# EAGLE design LinuxBoard_v1.7 (EAGLE 7.2.0)
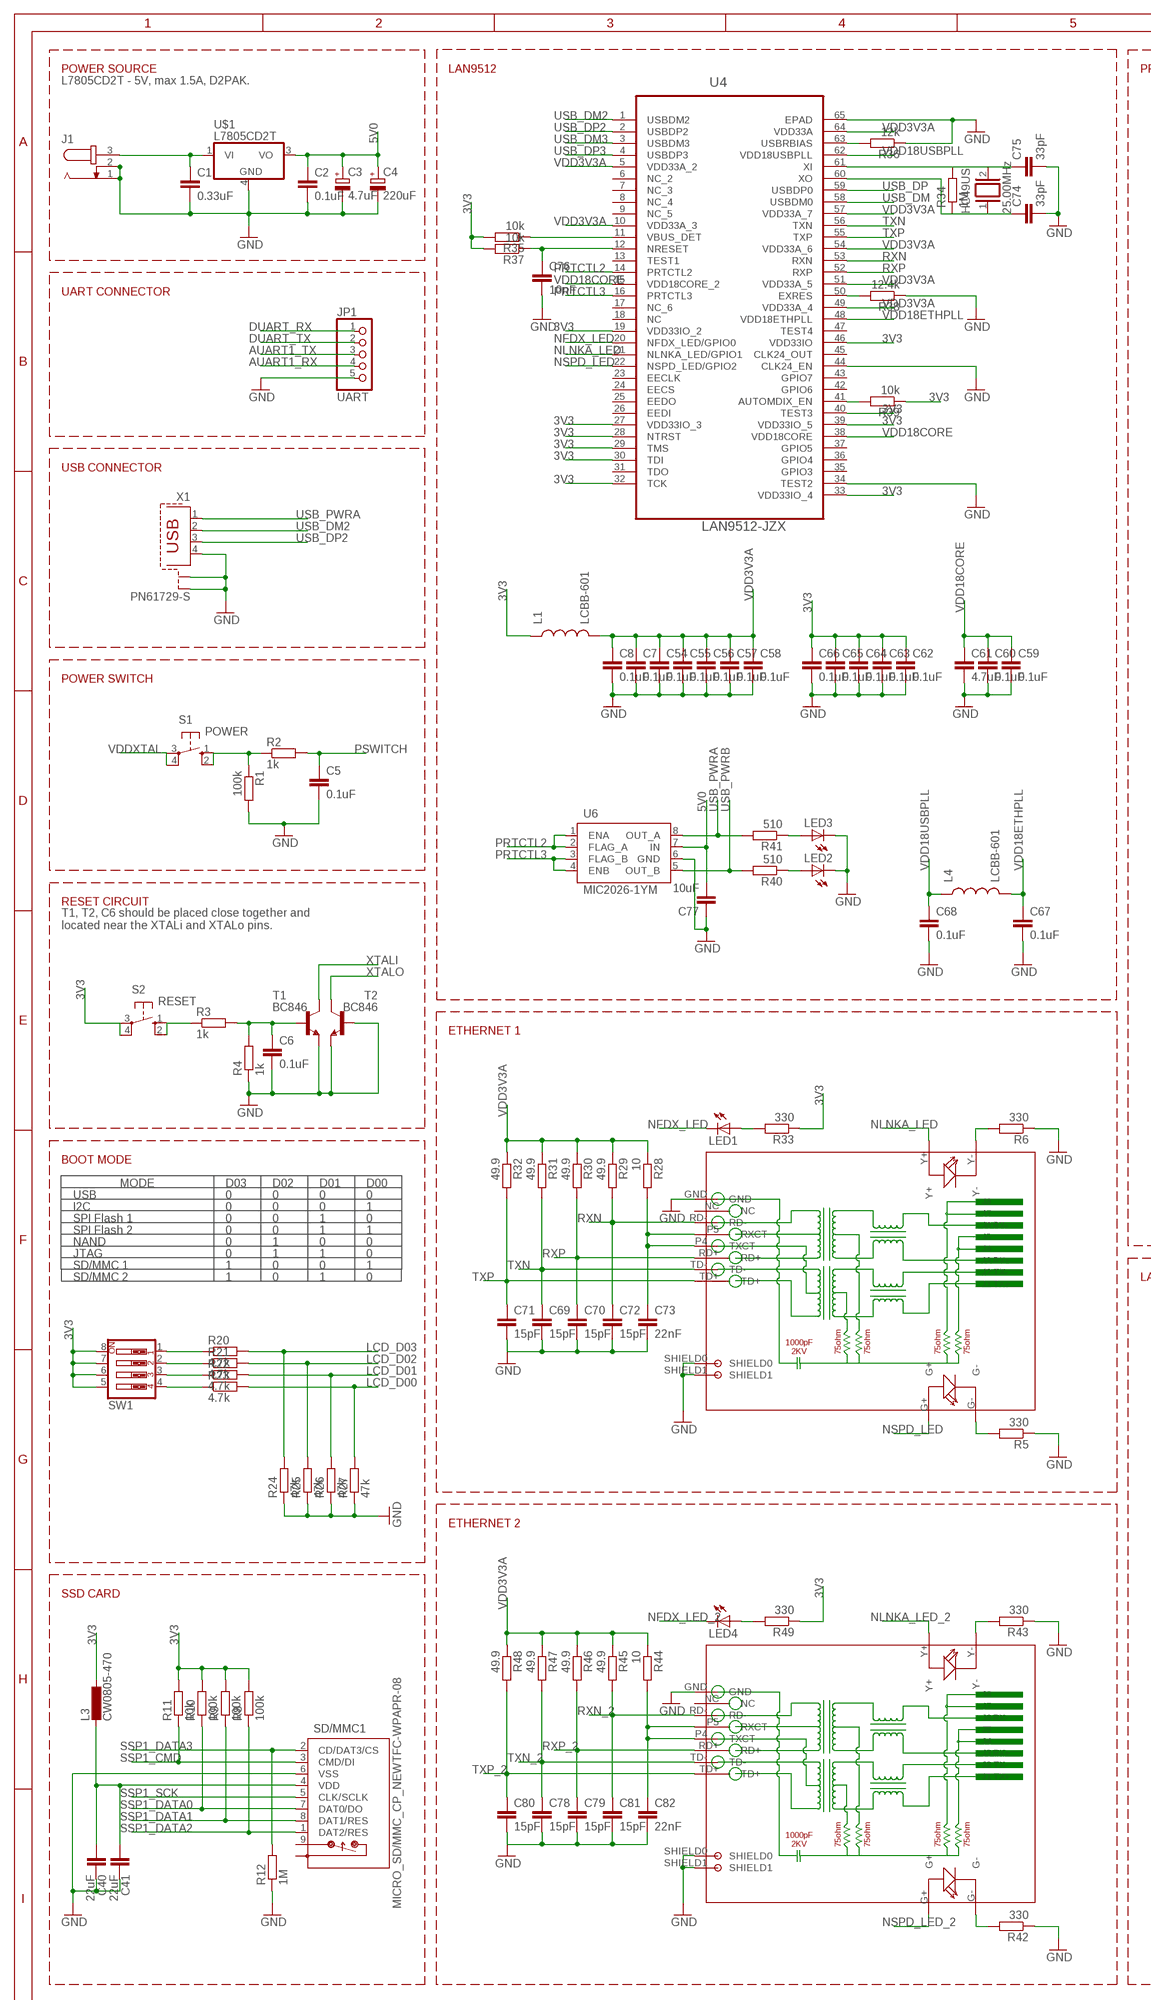
[diagram p0: schematic, sheet 1, part 1 of 2]
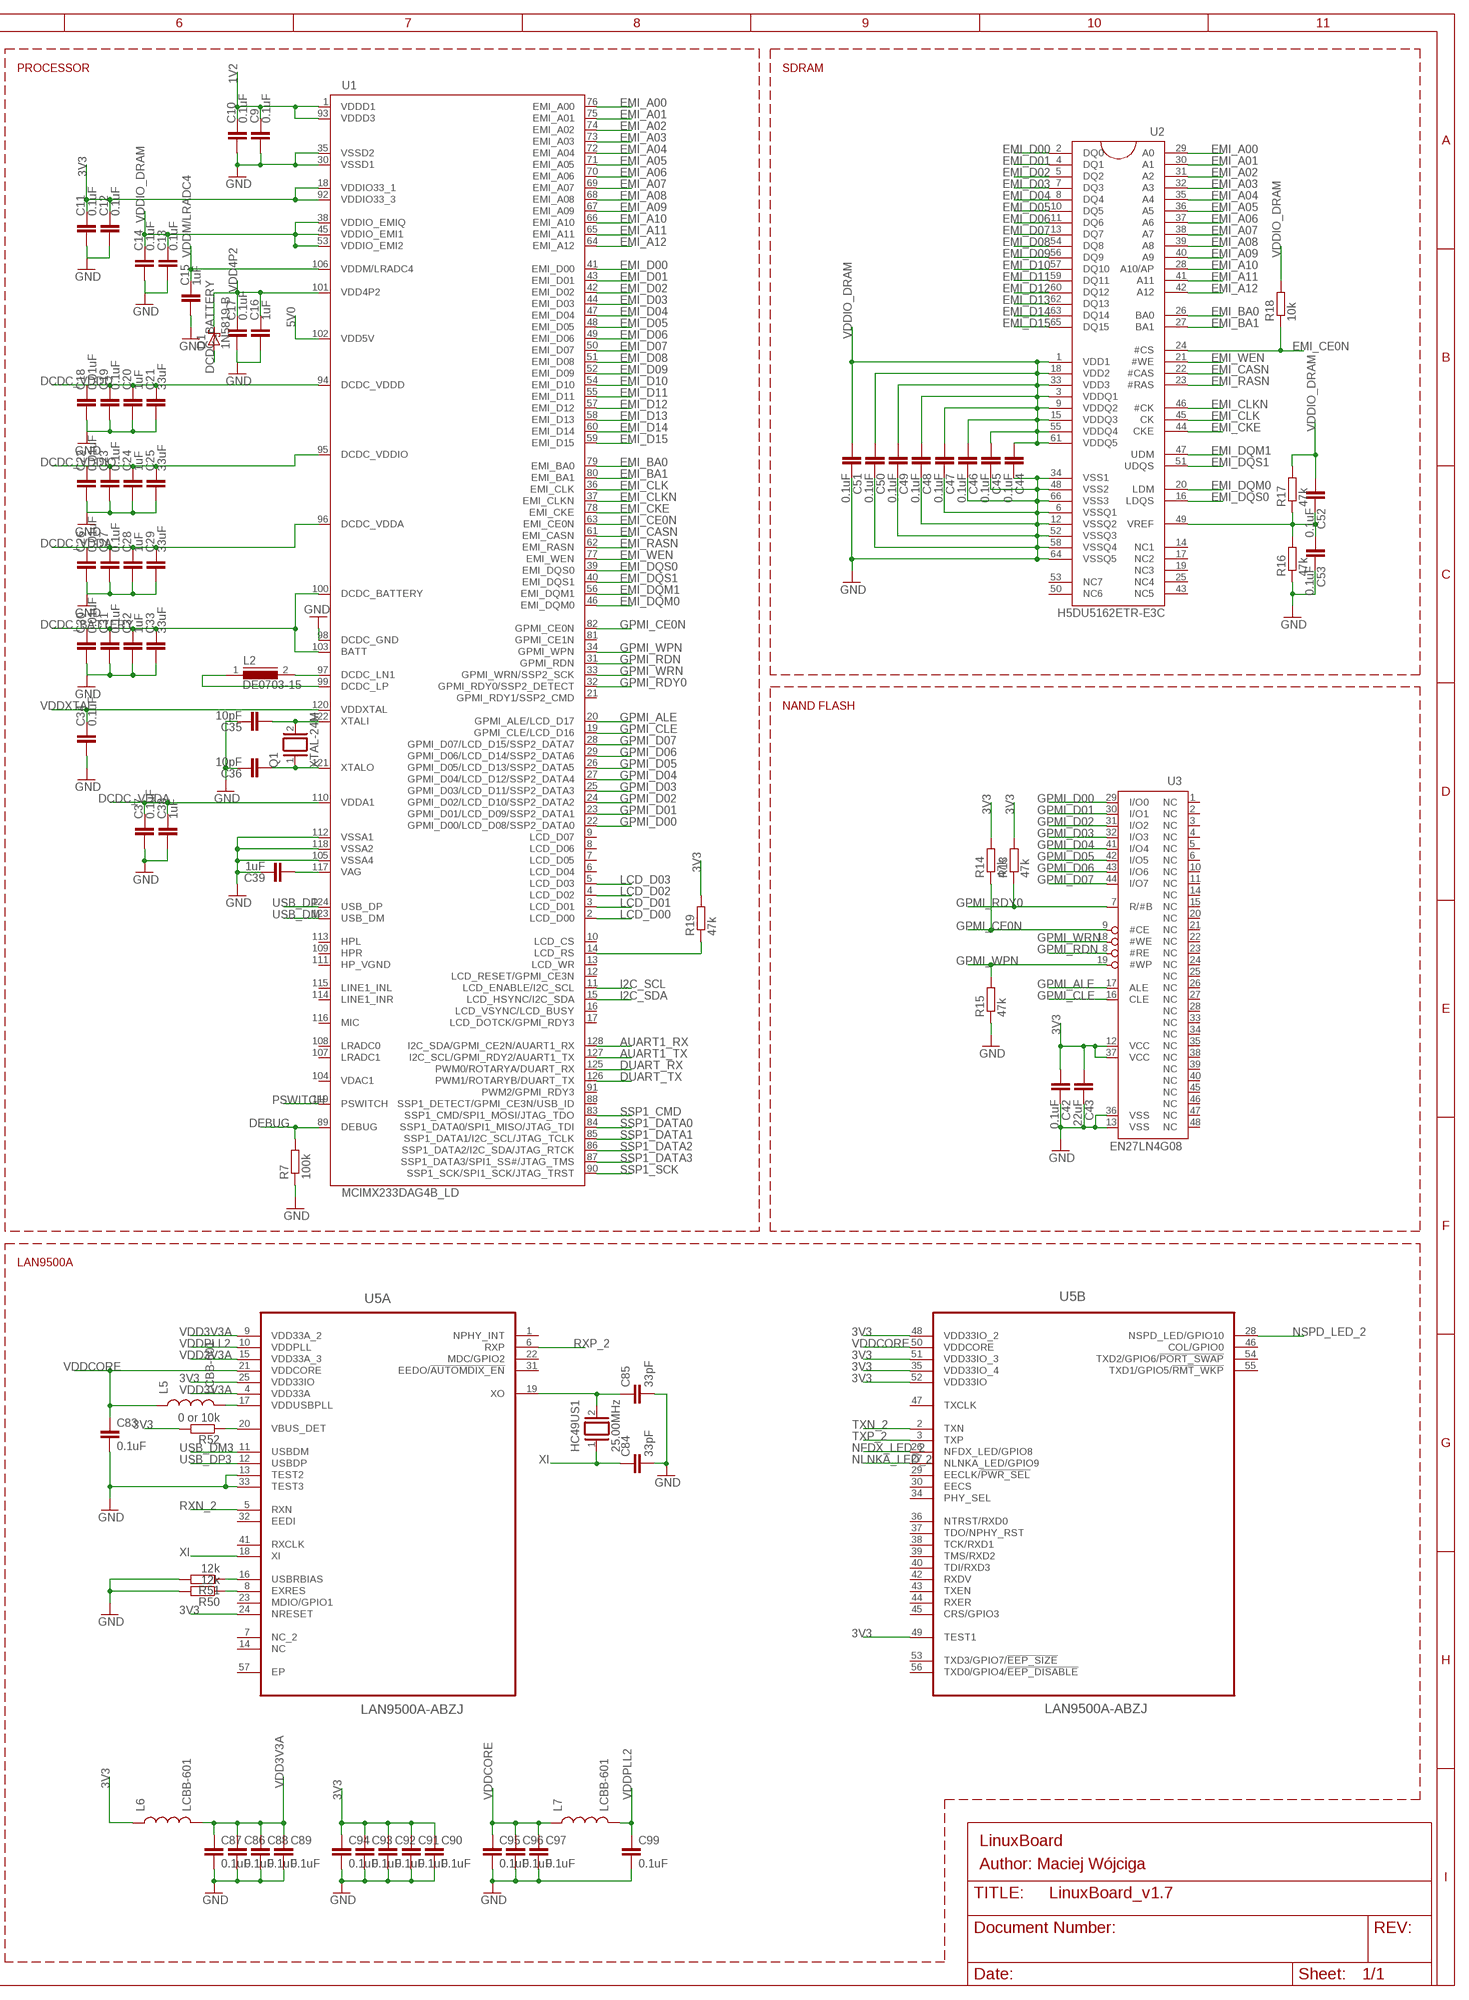
[diagram p1: schematic, sheet 1, part 2 of 2]

## Parts
C1  0.33uF  C-EUC0805  [C0805]
C2  0.1uF  C-EUC0805  [C0805]
C3  4.7uF  CPOL-EUE2-5  [E2-5]
C4  220uF  CPOL-EUE2-5  [E2-5]
C5  0.1uF  C-EUC0805  [C0805]
C6  0.1uF  C-EUC0805  [C0805]
C7  0.1uF  C-EUC0805  [C0805]
C8  0.1uF  C-EUC0805  [C0805]
C9  0.1uF  C-EUC0805  [C0805]
C10  0.1uF  C-EUC0805  [C0805]
C11  0.1uF  C-EUC0805  [C0805]
C12  0.1uF  C-EUC0805  [C0805]
C13  0.1uF  C-EUC0805  [C0805]
C14  0.1uF  C-EUC0805  [C0805]
C15  1uF  C-EUC0805  [C0805]
C16  1uF  C-EUC0805  [C0805]
C17  0.1uF  C-EUC0805  [C0805]
C18  0.01uF  C-EUC0805  [C0805]
C19  0.1uF  C-EUC0805  [C0805]
C20  1uF  C-EUC0805  [C0805]
C21  33uF  C-EUC0805  [C0805]
C22  0.01uF  C-EUC0805  [C0805]
C23  0.1uF  C-EUC0805  [C0805]
C24  1uF  C-EUC0805  [C0805]
C25  33uF  C-EUC0805  [C0805]
C26  0.01uF  C-EUC0805  [C0805]
C27  0.1uF  C-EUC0805  [C0805]
C28  1uF  C-EUC0805  [C0805]
C29  33uF  C-EUC0805  [C0805]
C30  0.01uF  C-EUC0805  [C0805]
C31  0.1uF  C-EUC0805  [C0805]
C32  1uF  C-EUC0805  [C0805]
C33  33uF  C-EUC0805  [C0805]
C34  0.1uF  C-EUC0805  [C0805]
C35  10pF  C-EUC0805  [C0805]
C36  10pF  C-EUC0805  [C0805]
C37  0.1uF  C-EUC0805  [C0805]
C38  1uF  C-EUC0805  [C0805]
C39  1uF  C-EUC0805  [C0805]
C40  22uF  C-EUC0805  [C0805]
C41  22uF  C-EUC0805  [C0805]
C42  0.1uF  C-EUC0805  [C0805]
C43  22uF  C-EUC0805  [C0805]
C44  0.1uF  C-EUC0805  [C0805]
C45  0.1uF  C-EUC0805  [C0805]
C46  0.1uF  C-EUC0805  [C0805]
C47  0.1uF  C-EUC0805  [C0805]
C48  0.1uF  C-EUC0805  [C0805]
C49  0.1uF  C-EUC0805  [C0805]
C50  0.1uF  C-EUC0805  [C0805]
C51  0.1uF  C-EUC0805  [C0805]
C52  0.1uF  C-EUC0805  [C0805]
C53  0.1uF  C-EUC0805  [C0805]
C54  0.1uF  C-EUC0805  [C0805]
C55  0.1uF  C-EUC0805  [C0805]
C56  0.1uF  C-EUC0805  [C0805]
C57  0.1uF  C-EUC0805  [C0805]
C58  0.1uF  C-EUC0805  [C0805]
C59  0.1uF  C-EUC0805  [C0805]
C60  0.1uF  C-EUC0805  [C0805]
C61  4.7uF  C-EUC0805  [C0805]
C62  0.1uF  C-EUC0805  [C0805]
C63  0.1uF  C-EUC0805  [C0805]
C64  0.1uF  C-EUC0805  [C0805]
C65  0.1uF  C-EUC0805  [C0805]
C66  0.1uF  C-EUC0805  [C0805]
C67  0.1uF  C-EUC0805  [C0805]
C68  0.1uF  C-EUC0805  [C0805]
C69  15pF  C-EUC0805  [C0805]
C70  15pF  C-EUC0805  [C0805]
C71  15pF  C-EUC0805  [C0805]
C72  15pF  C-EUC0805  [C0805]
C73  22nF  C-EUC0805  [C0805]
C74  33pF  C-EUC0805  [C0805]
C75  33pF  C-EUC0805  [C0805]
C76  10nF  C-EUC0805  [C0805]
C77  10uF  C-EUC0805  [C0805]
C78  15pF  C-EUC0805  [C0805]
C79  15pF  C-EUC0805  [C0805]
C80  15pF  C-EUC0805  [C0805]
C81  15pF  C-EUC0805  [C0805]
C82  22nF  C-EUC0805  [C0805]
C83  0.1uF  C-EUC0805  [C0805]
C84  33pF  C-EUC0805  [C0805]
C85  33pF  C-EUC0805  [C0805]
C86  0.1uF  C-EUC0805  [C0805]
C87  0.1uF  C-EUC0805  [C0805]
C88  0.1uF  C-EUC0805  [C0805]
C89  0.1uF  C-EUC0805  [C0805]
C90  0.1uF  C-EUC0805  [C0805]
C91  0.1uF  C-EUC0805  [C0805]
C92  0.1uF  C-EUC0805  [C0805]
C93  0.1uF  C-EUC0805  [C0805]
C94  0.1uF  C-EUC0805  [C0805]
C95  0.1uF  C-EUC0805  [C0805]
C96  0.1uF  C-EUC0805  [C0805]
C97  0.1uF  C-EUC0805  [C0805]
C99  0.1uF  C-EUC0805  [C0805]
D1  1N5819-B  [DO41-7.6]
HC49US  25.00MHz  XTAL/S  [QS]
HC49US1  25.00MHz  XTAL/S  [QS]
J1  JACK-PLUG0  [SPC4077]
JP1  UART  PINHD-1X5  [1X05]
L1  LCBB-601  INDUCTOR0805  [0805]
L2  DE0703-15  DR73  [DR73]
L3  CW0805-470  L-EUL2012C  [L2012C]
L4  LCBB-601  INDUCTOR0805  [0805]
L5  LCBB-601  INDUCTOR0805  [0805]
L6  LCBB-601  INDUCTOR0805  [0805]
L7  LCBB-601  INDUCTOR0805  [0805]
LED1  LEDSML0805  [SML0805]
LED2  LEDSML0805  [SML0805]
LED3  LEDSML0805  [SML0805]
LED4  LEDSML0805  [SML0805]
Q1  XTAL-24M  XTAL/S  [QS]
R1  100k  R-EU_R0805  [R0805]
R2  1k  R-EU_R0805  [R0805]
R3  1k  R-EU_R0805  [R0805]
R4  1k  R-EU_R0805  [R0805]
R5  330  R-EU_R0805  [R0805]
R6  330  R-EU_R0805  [R0805]
R7  100k  R-EU_R0805  [R0805]
R8  100k  R-EU_R0805  [R0805]
R9  100k  R-EU_R0805  [R0805]
R10  100k  R-EU_R0805  [R0805]
R11  10k  R-EU_R0805  [R0805]
R12  1M  R-EU_R0805  [R0805]
R13  47k  R-EU_R0805  [R0805]
R14  47k  R-EU_R0805  [R0805]
R15  47k  R-EU_R0805  [R0805]
R16  47k  R-EU_R0805  [R0805]
R17  47k  R-EU_R0805  [R0805]
R18  10k  R-EU_R0805  [R0805]
R19  47k  R-EU_R0805  [R0805]
R20  4.7k  R-EU_R0805  [R0805]
R21  4.7k  R-EU_R0805  [R0805]
R22  4.7k  R-EU_R0805  [R0805]
R23  4.7k  R-EU_R0805  [R0805]
R24  47k  R-EU_R0805  [R0805]
R25  47k  R-EU_R0805  [R0805]
R26  47k  R-EU_R0805  [R0805]
R27  47k  R-EU_R0805  [R0805]
R28  10  R-EU_R0805  [R0805]
R29  49.9  R-EU_R0805  [R0805]
R30  49.9  R-EU_R0805  [R0805]
R31  49.9  R-EU_R0805  [R0805]
R32  49.9  R-EU_R0805  [R0805]
R33  330  R-EU_R0805  [R0805]
R34  1M  R-EU_R0805  [R0805]
R35  10k  R-EU_R0805  [R0805]
R36  12k  R-EU_R0805  [R0805]
R37  10k  R-EU_R0805  [R0805]
R38  12.4k  R-EU_R0805  [R0805]
R39  10k  R-EU_R0805  [R0805]
R40  510  R-EU_R0805  [R0805]
R41  510  R-EU_R0805  [R0805]
R42  330  R-EU_R0805  [R0805]
R43  330  R-EU_R0805  [R0805]
R44  10  R-EU_R0805  [R0805]
R45  49.9  R-EU_R0805  [R0805]
R46  49.9  R-EU_R0805  [R0805]
R47  49.9  R-EU_R0805  [R0805]
R48  49.9  R-EU_R0805  [R0805]
R49  330  R-EU_R0805  [R0805]
R50  12k  R-EU_R0805  [R0805]
R51  12k  R-EU_R0805  [R0805]
R52  0 or 10k  R-EU_R0805  [R0805]
RJ1  HR911105A  [HR911105A]
RJ2  HR911105A  [HR911105A]
S1  POWER  10-XX  [B3F-10XX]
S2  RESET  10-XX  [B3F-10XX]
SD/MMC1  MICRO_SD/MMC_CP_NEWTFC-WPAPR-08  [TFC-WPAPR-08]
SW1  SW_DIP-4  [EDG-04]
T1  BC846  [SOT23]
T2  BC846  [SOT23]
U1  MCIMX233DAG4B_LD  [TQFP128LD]
U2  H5DU5162ETR-E3C  HY5DU121622D(L)T(P)-J  [66TSOP-II]
U3  EN27LN4G08  H27UBG8T2A  [TSOP48]
U4  LAN9512-JZX  [QFN50P900X900X100-65N]
U5  LAN9500A-ABZJ  [QFN50P800X800X100-57N]
U6  MIC2026-1YM  [SO-8]
U$1  L7805CD2T  [D2PAK-3]
X1  PN61729-S  [PN61729-S]

## Nets
1V2: C9.1 C10.1 U1.1(VDDD1) U1.93(VDDD3)
3V3: C11.1 C12.1 C42.2 C43.2 C62.1 C63.1 C64.1 C65.1 C66.1 C90.1 C91.1 C92.1 C93.1 C94.1 L1.1 L3.1 L6.1 R8.2 R9.2 R10.2 R11.2 R13.2 R14.2 R19.2 R33.1 R35.2 R37.2 R39.1 R49.1 R52.2 S2.3(P) S2.4(P1) SW1.5 SW1.6 SW1.7 SW1.8 U1.18(VDDIO33_1) U1.92(VDDIO33_3) U3.12(VCC) U3.37(VCC) U4.19(VDD33IO_2) U4.27(VDD33IO_3) U4.28(NTRST) U4.29(TMS) U4.30(TDI) U4.32(TCK) U4.33(VDD33IO_4) U4.39(VDD33IO_5) U4.40(TEST3) U4.46(VDD33IO) U5.24(A:NRESET) U5.25(A:VDD33IO) U5.35(B:VDD33IO_4) U5.48(B:VDD33IO_2) U5.49(B:TEST1) U5.51(B:VDD33IO_3) U5.52(B:VDD33IO)
5V0: C2.1 C3.+ C4.+ C77.2 U1.102(VDD5V) U6.7(IN) U$1.3(VO)
AUART1_RX: JP1.4 U1.128(I2C_SDA/GPMI_CE2N/AUART1_RX)
AUART1_TX: JP1.3 U1.127(I2C_SCL/GPMI_RDY2/AUART1_TX)
DCDC_BATTERY: C30.1 C31.1 C32.1 C33.1 D1.A U1.100(DCDC_BATTERY) U1.103(BATT)
DCDC_VDDA: C26.1 C27.1 C28.1 C29.1 C37.1 C38.1 U1.96(DCDC_VDDA) U1.110(VDDA1)
DCDC_VDDD: C18.1 C19.1 C20.1 C21.1 U1.94(DCDC_VDDD)
DCDC_VDDIO: C22.1 C23.1 C24.1 C25.1 U1.95(DCDC_VDDIO)
DEBUG: R7.2 U1.89(DEBUG)
DUART_RX: JP1.1 U1.125(PWM0/ROTARYA/DUART_RX)
DUART_TX: JP1.2 U1.126(PWM1/ROTARYB/DUART_TX)
EMI_A00: U1.76(EMI_A00) U2.29(A0)
EMI_A01: U1.75(EMI_A01) U2.30(A1)
EMI_A02: U1.74(EMI_A02) U2.31(A2)
EMI_A03: U1.73(EMI_A03) U2.32(A3)
EMI_A04: U1.72(EMI_A04) U2.35(A4)
EMI_A05: U1.71(EMI_A05) U2.36(A5)
EMI_A06: U1.70(EMI_A06) U2.37(A6)
EMI_A07: U1.69(EMI_A07) U2.38(A7)
EMI_A08: U1.68(EMI_A08) U2.39(A8)
EMI_A09: U1.67(EMI_A09) U2.40(A9)
EMI_A10: U1.66(EMI_A10) U2.28(A10/AP)
EMI_A11: U1.65(EMI_A11) U2.41(A11)
EMI_A12: U1.64(EMI_A12) U2.42(A12)
EMI_BA0: U1.79(EMI_BA0) U2.26(BA0)
EMI_BA1: U1.80(EMI_BA1) U2.27(BA1)
EMI_CASN: U1.61(EMI_CASN) U2.22(#CAS)
EMI_CE0N: R18.1 U1.63(EMI_CE0N) U2.24(#CS)
EMI_CKE: U1.78(EMI_CKE) U2.44(CKE)
EMI_CLK: U1.36(EMI_CLK) U2.45(CK)
EMI_CLKN: U1.37(EMI_CLKN) U2.46(#CK)
EMI_D00: U1.41(EMI_D00) U2.2(DQ0)
EMI_D01: U1.43(EMI_D01) U2.4(DQ1)
EMI_D02: U1.42(EMI_D02) U2.5(DQ2)
EMI_D03: U1.44(EMI_D03) U2.7(DQ3)
EMI_D04: U1.47(EMI_D04) U2.8(DQ4)
EMI_D05: U1.48(EMI_D05) U2.10(DQ5)
EMI_D06: U1.49(EMI_D06) U2.11(DQ6)
EMI_D07: U1.50(EMI_D07) U2.13(DQ7)
EMI_D08: U1.51(EMI_D08) U2.54(DQ8)
EMI_D09: U1.52(EMI_D09) U2.56(DQ9)
EMI_D10: U1.54(EMI_D10) U2.57(DQ10)
EMI_D11: U1.55(EMI_D11) U2.59(DQ11)
EMI_D12: U1.57(EMI_D12) U2.60(DQ12)
EMI_D13: U1.58(EMI_D13) U2.62(DQ13)
EMI_D14: U1.60(EMI_D14) U2.63(DQ14)
EMI_D15: U1.59(EMI_D15) U2.65(DQ15)
EMI_DQM0: U1.46(EMI_DQM0) U2.20(LDM)
EMI_DQM1: U1.56(EMI_DQM1) U2.47(UDM)
EMI_DQS0: U1.39(EMI_DQS0) U2.16(LDQS)
EMI_DQS1: U1.40(EMI_DQS1) U2.51(UDQS)
EMI_RASN: U1.62(EMI_RASN) U2.23(#RAS)
EMI_WEN: U1.77(EMI_WEN) U2.21(#WE)
GND: C1.2 C2.2 C3.- C4.- C5.2 C6.2 C7.2 C8.2 C9.2 C10.2 C11.2 C12.2 C13.2 C14.2 C15.2 C16.2 C17.2 C18.2 C19.2 C20.2 C21.2 C22.2 C23.2 C24.2 C25.2 C26.2 C27.2 C28.2 C29.2 C30.2 C31.2 C32.2 C33.2 C34.2 C35.1 C36.1 C37.2 C38.2 C39.1 C40.1 C41.1 C42.1 C43.1 C44.1 C45.1 C46.1 C47.1 C48.1 C49.1 C50.1 C51.1 C53.1 C54.2 C55.2 C56.2 C57.2 C58.2 C59.2 C60.2 C61.2 C62.2 C63.2 C64.2 C65.2 C66.2 C67.2 C68.2 C69.2 C70.2 C71.2 C72.2 C73.2 C74.2 C75.2 C76.2 C77.1 C78.2 C79.2 C80.2 C81.2 C82.2 C83.2 C84.2 C85.2 C86.2 C87.2 C88.2 C89.2 C90.2 C91.2 C92.2 C93.2 C94.2 C95.2 C96.2 C97.2 C99.2 J1.1 J1.2 JP1.5 LED2.C LED3.C R1.2 R4.1 R5.1 R6.1 R7.1 R12.1 R15.1 R16.1 R24.1 R25.1 R26.1 R27.1 R36.1 R38.1 R42.1 R43.1 R50.2 R51.2 RJ1.GND RJ1.SHIELD0 RJ1.SHIELD1 RJ2.GND RJ2.SHIELD0 RJ2.SHIELD1 SD/MMC1.6(VSS) T1.2(E) T2.1(B) T2.2(E) U1.30(VSSD1) U1.35(VSSD2) U1.98(DCDC_GND) U1.105(VSSA4) U1.112(VSSA1) U1.118(VSSA2) U2.6(VSSQ1) U2.12(VSSQ2) U2.34(VSS1) U2.48(VSS2) U2.52(VSSQ3) U2.58(VSSQ4) U2.64(VSSQ5) U2.66(VSS3) U3.13(VSS) U3.36(VSS) U4.34(TEST2) U4.44(CLK24_EN) U4.65(EPAD) U5.13(A:TEST2) U5.33(A:TEST3) U6.6(GND) U$1.4(GND) X1.4 X1.S1 X1.S2
GPMI_ALE: U1.20(GPMI_ALE/LCD_D17) U3.17(ALE)
GPMI_CE0N: R14.1 U1.82(GPMI_CE0N) U3.9(#CE)
GPMI_CLE: U1.19(GPMI_CLE/LCD_D16) U3.16(CLE)
GPMI_D00: U1.22(GPMI_D00/LCD_D08/SSP2_DATA0) U3.29(I/O0)
GPMI_D01: U1.23(GPMI_D01/LCD_D09/SSP2_DATA1) U3.30(I/O1)
GPMI_D02: U1.24(GPMI_D02/LCD_D10/SSP2_DATA2) U3.31(I/O2)
GPMI_D03: U1.25(GPMI_D03/LCD_D11/SSP2_DATA3) U3.32(I/O3)
GPMI_D04: U1.27(GPMI_D04/LCD_D12/SSP2_DATA4) U3.41(I/O4)
GPMI_D05: U1.26(GPMI_D05/LCD_D13/SSP2_DATA5) U3.42(I/O5)
GPMI_D06: U1.29(GPMI_D06/LCD_D14/SSP2_DATA6) U3.43(I/O6)
GPMI_D07: U1.28(GPMI_D07/LCD_D15/SSP2_DATA7) U3.44(I/O7)
GPMI_RDN: U1.31(GPMI_RDN) U3.8(#RE)
GPMI_RDY0: R13.1 U1.32(GPMI_RDY0/SSP2_DETECT) U3.7(R/#B)
GPMI_WPN: R15.2 U1.34(GPMI_WPN) U3.19(#WP)
GPMI_WRN: U1.33(GPMI_WRN/SSP2_SCK) U3.18(#WE)
I2C_SCL: U1.11(LCD_ENABLE/I2C_SCL)
I2C_SDA: U1.15(LCD_HSYNC/I2C_SDA)
LCD_D00: R23.2 R27.2 U1.2(LCD_D00)
LCD_D01: R22.2 R26.2 U1.3(LCD_D01)
LCD_D02: R21.2 R25.2 U1.4(LCD_D02)
LCD_D03: R20.2 R24.2 U1.5(LCD_D03)
N$1: C1.1 J1.3 U$1.1(VI)
N$2: R3.1 S2.1(S) S2.2(S1)
N$3: R1.1 R2.1 S1.1(S) S1.2(S1)
N$4: C6.1 R3.2 R4.2 T1.1(B)
N$5: R20.1 SW1.1
N$6: R21.1 SW1.2
N$7: R22.1 SW1.3
N$8: R23.1 SW1.4
N$9: L2.2 U1.97(DCDC_LN1)
N$10: R5.2 RJ1.G-
N$11: L2.1 U1.99(DCDC_LP)
N$12: C39.2 U1.117(VAG)
N$13: R19.1 U1.14(LCD_RS)
N$14: R6.2 RJ1.Y-
N$15: C75.1 HC49US.2 R34.2 U4.61(XI)
N$16: C40.2 C41.2 L3.2 SD/MMC1.4(VDD)
N$17: C73.1 R28.2 RJ1.P4(TXCT) RJ1.P5(RXCT)
N$18: LED1.A R33.2
N$19: C74.1 HC49US.1 R34.1 U4.60(XO)
N$20: R35.1 U4.11(VBUS_DET)
N$21: R36.2 U4.63(USBRBIAS)
N$22: C76.1 R37.1 U4.12(NRESET)
N$23: R38.2 U4.50(EXRES)
N$24: R42.2 RJ2.G-
N$25: R39.2 U4.41(AUTOMDIX_EN)
N$26: C52.1 C53.2 R16.2 R17.1 U2.49(VREF)
N$27: R43.2 RJ2.Y-
N$28: LED3.A R41.1
N$29: LED2.A R40.1
N$30: C82.1 R44.2 RJ2.P4(TXCT) RJ2.P5(RXCT)
N$31: LED4.A R49.2
N$32: L5.2 U5.17(A:VDDUSBPLL)
N$33: C85.1 HC49US1.2 U5.19(A:XO)
N$34: R51.1 U5.16(A:USBRBIAS)
N$35: R50.1 U5.8(A:EXRES)
N$36: R52.1 U5.20(A:VBUS_DET)
NFDX_LED: LED1.C U4.20(NFDX_LED/GPIO0)
NFDX_LED_2: LED4.C U5.26(B:NFDX_LED/GPIO8)
NLNKA_LED: RJ1.Y+ U4.21(NLNKA_LED/GPIO1)
NLNKA_LED_2: RJ2.Y+ U5.27(B:NLNKA_LED/GPIO9)
NSPD_LED: RJ1.G+ U4.22(NSPD_LED/GPIO2)
NSPD_LED_2: RJ2.G+ U5.28(B:NSPD_LED/GPIO10)
PRTCTL2: U4.14(PRTCTL2) U6.1(ENA) U6.2(FLAG_A)
PRTCTL3: U4.16(PRTCTL3) U6.3(FLAG_B) U6.4(ENB)
PSWITCH: C5.1 R2.2 U1.119(PSWITCH)
RXN: C72.1 R29.2 RJ1.RD- U4.53(RXN)
RXN_2: C81.1 R45.2 RJ2.RD- U5.5(A:RXN)
RXP: C70.1 R30.2 RJ1.RD+ U4.52(RXP)
RXP_2: C79.1 R46.2 RJ2.RD+ U5.6(A:RXP)
SSP1_CMD: R11.1 SD/MMC1.3(CMD/DI) U1.83(SSP1_CMD/SPI1_MOSI/JTAG_TDO)
SSP1_DATA0: R10.1 SD/MMC1.7(DAT0/DO) U1.84(SSP1_DATA0/SPI1_MISO/JTAG_TDI)
SSP1_DATA1: R9.1 SD/MMC1.8(DAT1/RES) U1.85(SSP1_DATA1/I2C_SCL/JTAG_TCLK)
SSP1_DATA2: R8.1 SD/MMC1.1(DAT2/RES) U1.86(SSP1_DATA2/I2C_SDA/JTAG_RTCK)
SSP1_DATA3: R12.2 SD/MMC1.2(CD/DAT3/CS) U1.87(SSP1_DATA3/SPI1_SS#/JTAG_TMS)
SSP1_SCK: SD/MMC1.5(CLK/SCLK) U1.90(SSP1_SCK/SPI1_SCK/JTAG_TRST)
TXN: C69.1 R31.2 RJ1.TD- U4.56(TXN)
TXN_2: C78.1 R47.2 RJ2.TD- U5.2(B:TXN)
TXP: C71.1 R32.2 RJ1.TD+ U4.55(TXP)
TXP_2: C80.1 R48.2 RJ2.TD+ U5.3(B:TXP)
USB_DM: U1.123(USB_DM) U4.58(USBDM0)
USB_DM2: U4.1(USBDM2) X1.2
USB_DM3: U4.3(USBDM3) U5.11(A:USBDM)
USB_DP: U1.124(USB_DP) U4.59(USBDP0)
USB_DP2: U4.2(USBDP2) X1.3
USB_DP3: U4.4(USBDP3) U5.12(A:USBDP)
USB_PWRA: R41.2 U6.8(OUT_A) X1.1
USB_PWRB: R40.2 U6.5(OUT_B)
VDD3V3A: C7.1 C8.1 C54.1 C55.1 C56.1 C57.1 C58.1 C86.1 C87.1 C88.1 C89.1 L1.2 L6.2 R28.1 R29.1 R30.1 R31.1 R32.1 R44.1 R45.1 R46.1 R47.1 R48.1 U4.5(VDD33A_2) U4.10(VDD33A_3) U4.49(VDD33A_4) U4.51(VDD33A_5) U4.54(VDD33A_6) U4.57(VDD33A_7) U4.64(VDD33A) U5.4(A:VDD33A) U5.9(A:VDD33A_2) U5.15(A:VDD33A_3)
VDD4P2: C16.1 C17.1 D1.C U1.101(VDD4P2)
VDD18CORE: C59.1 C60.1 C61.1 U4.15(VDD18CORE_2) U4.38(VDD18CORE)
VDD18ETHPLL: C67.1 L4.2 U4.48(VDD18ETHPLL)
VDD18USBPLL: C68.1 L4.1 U4.62(VDD18USBPLL)
VDDCORE: C83.1 C95.1 C96.1 C97.1 L5.1 L7.1 U5.21(A:VDDCORE) U5.50(B:VDDCORE)
VDDIO_DRAM: C13.1 C14.1 C44.2 C45.2 C46.2 C47.2 C48.2 C49.2 C50.2 C51.2 C52.2 R17.2 R18.2 U1.38(VDDIO_EMIQ) U1.45(VDDIO_EMI1) U1.53(VDDIO_EMI2) U2.1(VDD1) U2.3(VDDQ1) U2.9(VDDQ2) U2.15(VDDQ3) U2.18(VDD2) U2.33(VDD3) U2.55(VDDQ4) U2.61(VDDQ5)
VDDM/LRADC4: C15.1 U1.106(VDDM/LRADC4)
VDDPLL2: C99.1 L7.2 U5.10(A:VDDPLL)
VDDXTAL: C34.1 S1.3(P) S1.4(P1) U1.120(VDDXTAL)
XI: C84.1 HC49US1.1 U5.18(A:XI)
XTALI: C35.2 Q1.2 T1.3(C) U1.122(XTALI)
XTALO: C36.2 Q1.1 T2.3(C) U1.121(XTALO)
Unconnected: RJ1.NC RJ2.NC SD/MMC1.9(CP_E) SD/MMC1.10(PACK1) U1.6(LCD_D04) U1.7(LCD_D05) U1.8(LCD_D06) U1.9(LCD_D07) U1.10(LCD_CS) U1.12(LCD_RESET/GPMI_CE3N) U1.13(LCD_WR) U1.16(LCD_VSYNC/LCD_BUSY) U1.17(LCD_DOTCK/GPMI_RDY3) U1.21(GPMI_RDY1/SSP2_CMD) U1.81(GPMI_CE1N) U1.88(SSP1_DETECT/GPMI_CE3N/USB_ID) U1.91(PWM2/GPMI_RDY3) U1.104(VDAC1) U1.107(LRADC1) U1.108(LRADC0) U1.109(HPR) U1.113(HPL) U1.114(LINE1_INR) U1.115(LINE1_INL) U1.116(MIC) U2.14(NC1) U2.17(NC2) U2.19(NC3) U2.25(NC4) U2.43(NC5) U2.50(NC6) U2.53(NC7) U3.1(NC) U3.2(NC) U3.3(NC) U3.4(NC) U3.5(NC) U3.6(NC) U3.10(NC) U3.11(NC) U3.14(NC) U3.15(NC) U3.20(NC) U3.21(NC) U3.22(NC) U3.23(NC) U3.24(NC) U3.25(NC) U3.26(NC) U3.27(NC) U3.28(NC) U3.33(NC) U3.34(NC) U3.35(NC) U3.38(NC) U3.39(NC) U3.40(NC) U3.45(NC) U3.46(NC) U3.47(NC) U3.48(NC) U4.6(NC_2) U4.7(NC_3) U4.8(NC_4) U4.9(NC_5) U4.13(TEST1) U4.17(NC_6) U4.18(NC) U4.23(EECLK) U4.24(EECS) U4.25(EEDO) U4.26(EEDI) U4.31(TDO) U4.35(GPIO3) U4.36(GPIO4) U4.37(GPIO5) U4.42(GPIO6) U4.43(GPIO7) U4.45(CLK24_OUT) U4.47(TEST4) U5.1(A:NPHY_INT) U5.7(A:NC_2) U5.14(A:NC) U5.22(A:MDC/GPIO2) U5.23(A:MDIO/GPIO1) U5.29(B:EECLK/!PWR_SEL) U5.30(B:EECS) U5.31(A:EEDO/!AUTOMDIX_EN) U5.32(A:EEDI) U5.34(B:PHY_SEL) U5.36(B:NTRST/RXD0) U5.37(B:TDO/NPHY_RST) U5.38(B:TCK/RXD1) U5.39(B:TMS/RXD2) U5.40(B:TDI/RXD3) U5.41(A:RXCLK) U5.42(B:RXDV) U5.43(B:TXEN) U5.44(B:RXER) U5.45(B:CRS/GPIO3) U5.46(B:COL/GPIO0) U5.47(B:TXCLK) U5.53(B:TXD3/GPIO7/!EEP_SIZE) U5.54(B:TXD2/GPIO6/!PORT_SWAP) U5.55(B:TXD1/GPIO5/!RMT_WKP) U5.56(B:TXD0/GPIO4/!EEP_DISABLE) U5.57(A:EP)

## Notes on the sheet
- POWER SOURCE | LAN9512 | PROCESSOR | SDRAM
- L7805CD2T - 5V, max 1.5A, D2PAK.
- UART CONNECTOR
- USB CONNECTOR
- POWER SWITCH
- NAND FLASH
- RESET CIRCUIT
- T1, T2, C6 should be placed close together and
  located near the XTALi and XTALo pins.
- ETHERNET 1
- BOOT MODE
- MODE | D03 | D02 | D01 | D00
- USB | 0 | 0 | 0 | 0
- I2C | 0 | 0 | 0 | 1
- SPI Flash 1 | 0 | 0 | 1 | 0
- SPI Flash 2 | 0 | 0 | 1 | 1
- NAND | 0 | 1 | 0 | 0
- JTAG | 0 | 1 | 1 | 0
- SD/MMC 1 | 1 | 0 | 0 | 1
- SD/MMC 2 | 1 | 0 | 1 | 0 | LAN9500A
- ETHERNET 2
- SSD CARD
- LinuxBoard
- Author: Maciej Wójciga

## Power pins joined to a net without a drawn wire
HP_VGND: U1.111(HP_VGND)

## Library data of the parts
C1 C2 C5-C97 C99 = rcl:C-EU: CAPACITOR, European symbol
C3 C4 = rcl:CPOL-EU: POLARIZED CAPACITOR, European symbol
D1 = diode:1N581*: 1.0A SCHOTTKY BARRIER RECTIFIER Source: http://www.diodes.com/datasheets/ds23001.pdf
HC49US HC49US1 Q1 = special:XTAL/S: CRYSTAL
J1 = con-jack:JACK-PLUG: DC POWER JACK Power Jack, DC, Right Angle, Through Hole, Rated 5A at 16VDC, PC Terminals Distributor: Farnell (www.Farnell.de) Drawing: 84N1161.pdf / 84N1162.pdf Manufacturer: SPC Technology (www.spctechnology.com) Type: SPC4077 / SPC 4078; OC_FARNELL: unknown; OC_NEWARK: unknown
JP1 = pinhead:PINHD-1X5: PIN HEADER
L1 L4-L7 = SparkFun-Passives:INDUCTOR: Inductors Basic Inductor/Choke - 0603 and 1206. Footprints are not proven and vary greatly between part numbers. SRN6045- 33uH, 20% 1.4A SDR0403-560KL - 56uH, 10%, 500mA RMS/740mA peak
L2 = inductors:DR73: High Power Density, High Efficiency, Shielded Inductors Source: coiltronics_dr_series.pdf
L3 = rcl:L-EU: INDUCTOR, European symbol
LED1-LED4 = led:LED: LED OSRAM: - CHIPLED LG R971, LG N971, LY N971, LG Q971, LY Q971, LO R971, LY R971 LH N974, LH R974 LS Q976, LO Q976, LY Q976 LO Q996 - Hyper CHIPLED LW Q18S LB Q993, LB Q99A, LB R99A - SideLED LS A670, LO A670, LY A670, LG A670, LP A670 LB A673, LV A673, LT A673, LW A673 LH A674 LY A675 LS A676, LA A676, LO A676, LY A676, LW A676 LS A679, LY A679, LG A679 - Hyper Micro SIDELED® LS Y876, LA Y876, LO Y876, LY Y876 LT Y87S - SmartLED LW L88C, LW L88S LB L89C, LB L89S, LG L890 LS L89K, LO L89K, LY L89K LS L896, LA L896, LO L896, LY L896 - TOPLED LS T670, LO T670, LY T670, LG T670, LP T670 LSG T670, LSP T670, LSY T670, LOP T670, LYG T670 LG T671, LOG T671, LSG T671 LB T673, LV T673, LT T673, LW T673 LH T674 LS T676, LA T676, LO T676, LY T676, LB T676, LH T676, LSB T676, LW T676 LB T67C, LV T67C, LT T67C, LS T67K, LO T67K, LY T67K, LW E67C LS E67B, LA E67B, LO E67B, LY E67B, LB E67C, LV E67C, LT E67C LW T67C LS T679, LY T679, LG T679 LS T770, LO T770, LY T770, LG T770, LP T770 LB T773, LV T773, LT T773, LW T773 LH T774 LS E675, LA E675, LY E675, LS T675 LS T776, LA T776, LO T776, LY T776, LB T776 LHGB T686 LT T68C, LB T68C - Hyper Mini TOPLED® LB M676 - Mini TOPLED Santana® LG M470 LS M47K, LO M47K, LY M47K Source: http://www.osram.convergy.de LUXEON: - LUMILED® LXK2-PW12-R00, LXK2-PW12-S00, LXK2-PW14-U00, LXK2-PW14-V00 LXK2-PM12-R00, LXK2-PM12-S00, LXK2-PM14-U00 LXK2-PE12-Q00, LXK2-PE12-R00, LXK2-PE12-S00, LXK2-PE14-T00, LXK2-PE14-U00 LXK2-PB12-K00, LXK2-PB12-L00, LXK2-PB12-M00, LXK2-PB14-N00, LXK2-PB14-P00, LXK2-PB14-Q00 LXK2-PR12-L00, LXK2-PR12-M00, LXK2-PR14-Q00, LXK2-PR14-R00 LXK2-PD12-Q00, LXK2-PD12-R00, LXK2-PD12-S00 LXK2-PH12-R00, LXK2-PH12-S00 LXK2-PL12-P00, LXK2-PL12-Q00, LXK2-PL12-R00 Source: www.luxeon.com KINGBRIGHT: KA-3528ASYC Source: www.kingbright.com
R1-R52 = rcl:R-EU_: RESISTOR, European symbol
RJ1 RJ2 = CONNECTER:HR911105A
S1 S2 = switch-omron:10-XX: OMRON SWITCH; MPN: B3F-1000; OC_FARNELL: 176432; OC_NEWARK: 36M3542
SD/MMC1 = A13-OLinuXino_WIFI_Rev_G:MICRO_SD/MMC_CP_NEW
SW1 = special:SW_DIP-4: DIP SWITCH
T1 T2 = transistor:BC846: NPN TRANSISTOR
U1 = hosho:MCIMX233DAG4B: i.MX23
U2 = iMX233-OLinuXino-Micro_Rev_D:HY5DU121622D(L)T(P)
U3 = A13-OLinuXino_WIFI_Rev_G:H27UBG8T2A
U4 = hosho:LAN9512-JZX: IC, USB2 - ENET CNTRL 2-PORT HUB, 64VQFN; MPN: LAN9512-JZX; OC_FARNELL: 2292586; OC_NEWARK: 66W1988; PACKAGE: 64VQFN; SUPPLIER: Microchip
U5 = hosho:LAN9500A-ABZJ: Ethernet Controller,56VQFN; MPN: LAN9500A-ABZJ; OC_FARNELL: 2292585; OC_NEWARK: 66W1987; PACKAGE: 56VQFN; SUPPLIER: MICROCHIP
U6 = iMX233-OLINUXINO-MAXI_Rev_D:MIC2026: LM3526 Dual Port USB Power Switch and Over-Current Protection Features: -> Compatible with USB1.1 and USB2.0; -> 1 ms fault flag delay filters Hot-Plug events; -> Smooth turn-on eliminates in-rush induced voltage drop; -> UL recognized component: REF#205202; -> 1A nominal shortcircuit output current protects PC power supplies; -> Thermal shutdown protects device in direct short condition; -> 500mA minimum continuous load current; -> Small SO-8 package minimizes board space; -> 2.7V to 5.5V input voltage range; -> 140mOhm Max.switch resistance; -> 1 µA Max. standby current; -> 200µA Max. operating current; -> Under-voltage lockout(UVLO);
U$1 = hosho:L7805CD2T
X1 = con-berg:PN61729-S: BERG USB connector; OC_FARNELL: unknown; OC_NEWARK: unknown

## Net classes
1 pwr: width 0.5 mm, clearance 0.2 mm

## Board
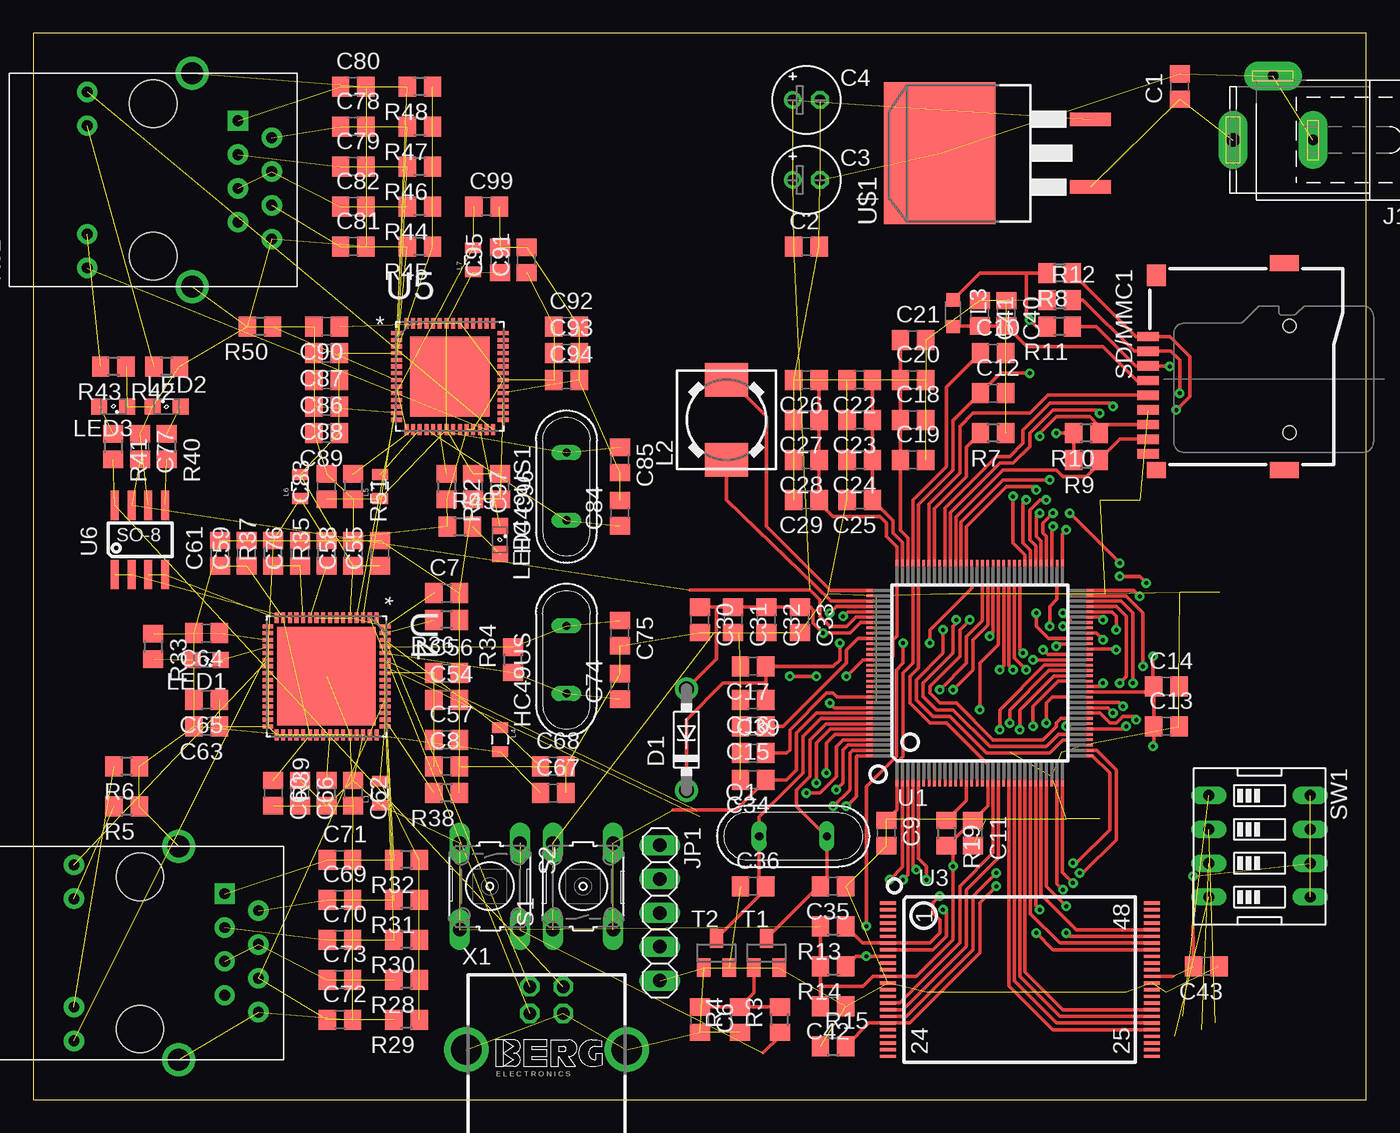
[diagram p2: board, top side]
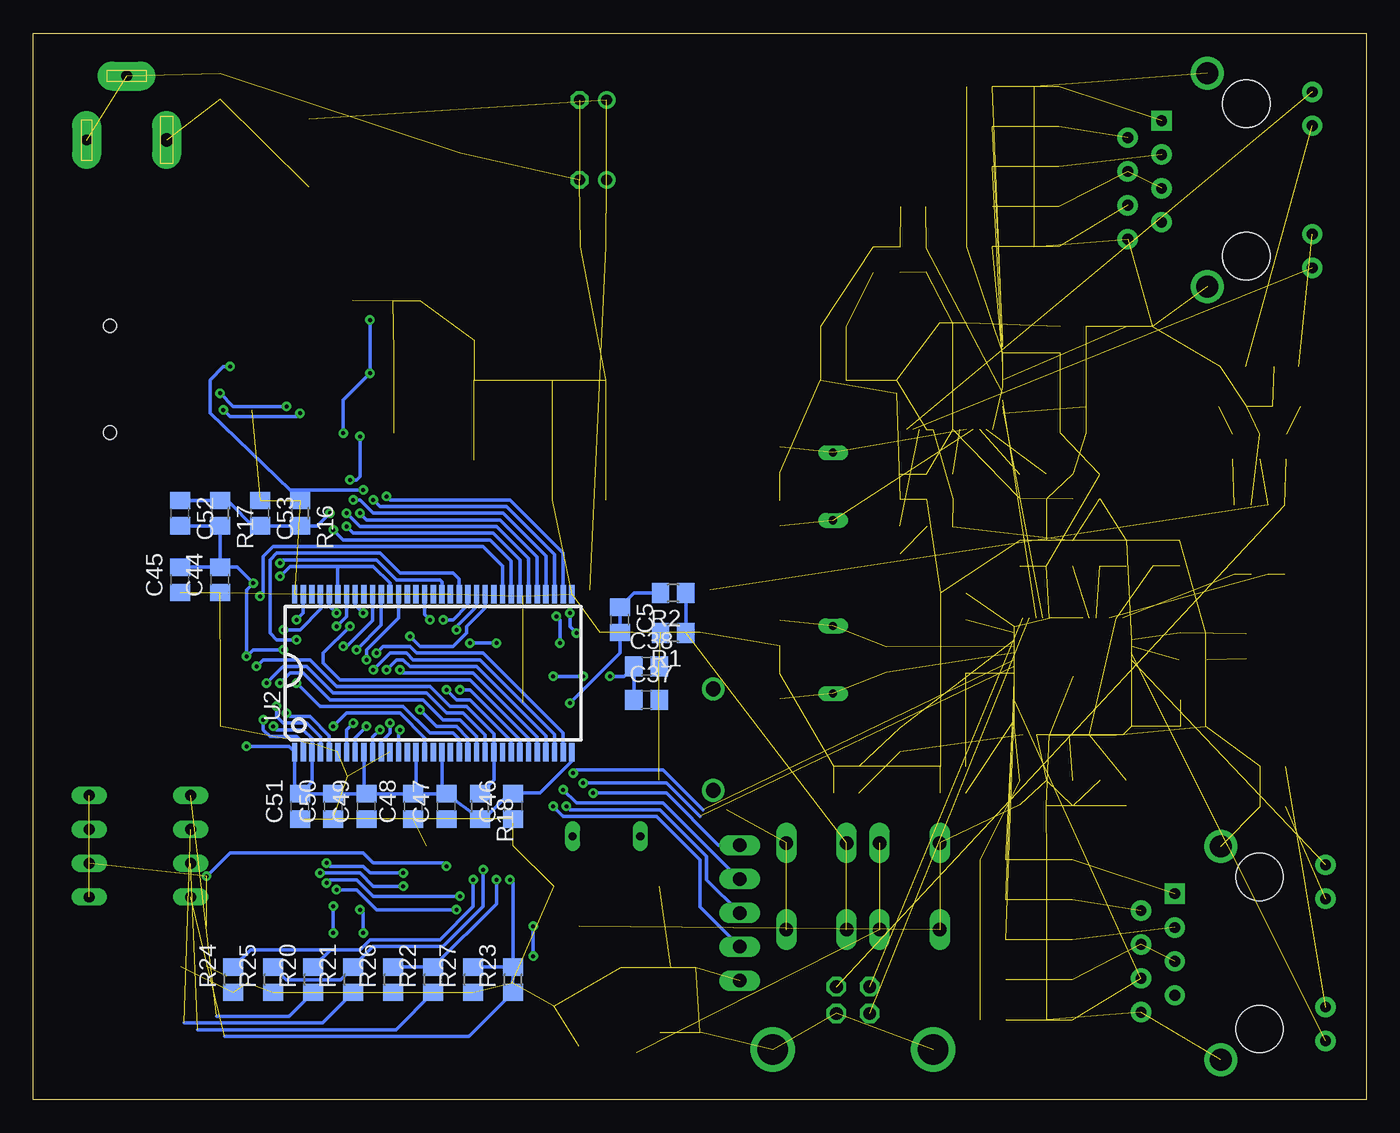
[diagram p3: board, bottom side, seen from below]

Size 100 x 80 mm. Coordinates in mm from the lower left corner, seen from the top.
Outline: 0,0 100,0 100,80 0,80 0,0
Copper layers (1*16): Top 0.035mm / dielectric 1.5mm / Bottom 0.035mm
Design rules "default *": minimum track width 10mil, minimum drill 24mil, track to track 8mil, track to pad 8mil, pad to pad 8mil, via to via 8mil, smd to smd 8mil, copper to edge 40mil, drill to drill 8mil, minimum pad ring 10mil, minimum via ring 8mil, stop-mask expansion 4mil, vias tented up to drill 12mil, thermal gap 10mil

### Footprints (pad centres in the part's own frame; a part is rotated, then mirrored left to right if it is on the bottom)
C0805 = smd 1.3 x 1.5: 1 -0.95,0; 2 0.95,0
E2-5 = drill 0.813 pad 1.27: + -1.016,0 | drill 0.813 pad 1.27 octagon: - 1.016,0
DO41-7.6 = drill 1.1 pad 1.7: A 3.81,0; C -3.81,0
QS = drill 0.61 long: 1 -2.54,0; 2 2.54,0
SPC4077 = drill 0.8 pad 2.184 long: 1 -3,0; 2 0,-4.8 | drill 1 pad 2.184 long: 3 3,0
1X05 = drill 1.016 long: 1 -5.08,0; 2 -2.54,0; 3 0,0; 4 2.54,0; 5 5.08,0
0805 = smd 0.8 x 1.2: 1 -0.9,0; 2 0.9,0
DR73 = smd 2.5 x 3.25: 1 -3,0; 2 3,0
L2012C = smd 1 x 1: 1 -1,0; 2 1,0
SML0805 = smd 1.2 x 1.2: A 1.05,0; C -1.05,0
R0805 = smd 1.3 x 1.5: 1 -0.95,0; 2 0.95,0
HR911105A = drill 0.813 pad 1.524: G+ 4.953,-6.604; G- 4.953,-4.064; GND -8.89,4.445; NC -6.35,3.175; P4 -8.89,-0.635; P5 -6.35,0.635; RD+ -6.35,-1.905; RD- -8.89,1.905; TD- -8.89,-3.175; Y+ 4.953,6.604; Y- 4.953,4.064 | drill 1.651 pad 2.159: SHIELD0 -2.921,8.001; SHIELD1 -2.921,-8.001 | drill 0.813 pad 1.524 square: TD+ -6.35,-4.445 | hole 3.556: 0,-5.715; 0,5.715
B3F-10XX = drill 1.016 long: 1 -3.251,2.261; 2 3.251,2.261; 3 -3.251,-2.261; 4 3.251,-2.261
TFC-WPAPR-08 = smd 1.6 x 0.7: 1 -7.375,2.25; 2 -7.375,1.15; 3 -7.375,0.05; 4 -7.375,-1.05; 5 -7.375,-2.15; 6 -7.375,-3.25; 7 -7.375,-4.35; 8 -7.375,-5.45; 9 -7.375,-6.55 | smd 1.4 x 1.2: 10 -6.75,-7.75 | smd 1.4 x 1.6: 11 -6.75,6.85 | smd 2.2 x 1.2: 12 2.85,-7.75; 13 2.85,7.75 | hole 1: 3.25,-4.95; 3.25,3.05
EDG-04 = drill 0.813 long: 1 -3.81,-3.81; 2 -1.27,-3.81; 3 1.27,-3.81; 4 3.81,-3.81; 5 3.81,3.81; 6 1.27,3.81; 7 -1.27,3.81; 8 -3.81,3.81
SOT23 = smd 1 x 1.4: 1 -0.95,-1.1; 2 0.95,-1.1; 3 0,1.1
TQFP128LD = smd 0.2 x 1.5: 1 -6.2,-7.75; 2 -5.8,-7.75; 3 -5.4,-7.75; 4 -5,-7.75; 5 -4.6,-7.75; 6 -4.2,-7.75; 7 -3.8,-7.75; 8 -3.4,-7.75; 9 -3,-7.75; 10 -2.6,-7.75; 11 -2.2,-7.75; 12 -1.8,-7.75; 13 -1.4,-7.75; 14 -1,-7.75; 15 -0.6,-7.75; 16 -0.2,-7.75; 17 0.2,-7.75; 18 0.6,-7.75; 19 1,-7.75; 20 1.4,-7.75; 21 1.8,-7.75; 22 2.2,-7.75; 23 2.6,-7.75; 24 3,-7.75; 25 3.4,-7.75; 26 3.8,-7.75; 27 4.2,-7.75; 28 4.6,-7.75; 29 5,-7.75; 30 5.4,-7.75; 31 5.8,-7.75; 32 6.2,-7.75; 65 6.2,7.75; 66 5.8,7.75; 67 5.4,7.75; 68 5,7.75; 69 4.6,7.75; 70 4.2,7.75; 71 3.8,7.75; 72 3.4,7.75; 73 3,7.75; 74 2.6,7.75; 75 2.2,7.75; 76 1.8,7.75; 77 1.4,7.75; 78 1,7.75; 79 0.6,7.75; 80 0.2,7.75; 81 -0.2,7.75; 82 -0.6,7.75; 83 -1,7.75; 84 -1.4,7.75; 85 -1.8,7.75; 86 -2.2,7.75; 87 -2.6,7.75; 88 -3,7.75; 89 -3.4,7.75; 90 -3.8,7.75; 91 -4.2,7.75; 92 -4.6,7.75; 93 -5,7.75; 94 -5.4,7.75; 95 -5.8,7.75; 96 -6.2,7.75 | smd 1.5 x 0.2: 33 7.75,-6.2; 34 7.75,-5.8; 35 7.75,-5.4; 36 7.75,-5; 37 7.75,-4.6; 38 7.75,-4.2; 39 7.75,-3.8; 40 7.75,-3.4; 41 7.75,-3; 42 7.75,-2.6; 43 7.75,-2.2; 44 7.75,-1.8; 45 7.75,-1.4; 46 7.75,-1; 47 7.75,-0.6; 48 7.75,-0.2; 49 7.75,0.2; 50 7.75,0.6; 51 7.75,1; 52 7.75,1.4; 53 7.75,1.8; 54 7.75,2.2; 55 7.75,2.6; 56 7.75,3; 57 7.75,3.4; 58 7.75,3.8; 59 7.75,4.2; 60 7.75,4.6; 61 7.75,5; 62 7.75,5.4; 63 7.75,5.8; 64 7.75,6.2; 97 -7.75,6.2; 98 -7.75,5.8; 99 -7.75,5.4; 100 -7.75,5; 101 -7.75,4.6; 102 -7.75,4.2; 103 -7.75,3.8; 104 -7.75,3.4; 105 -7.75,3; 106 -7.75,2.6; 107 -7.75,2.2; 108 -7.75,1.8; 109 -7.75,1.4; 110 -7.75,1; 111 -7.75,0.6; 112 -7.75,0.2; 113 -7.75,-0.2; 114 -7.75,-0.6; 115 -7.75,-1; 116 -7.75,-1.4; 117 -7.75,-1.8; 118 -7.75,-2.2; 119 -7.75,-2.6; 120 -7.75,-3; 121 -7.75,-3.4; 122 -7.75,-3.8; 123 -7.75,-4.2; 124 -7.75,-4.6; 125 -7.75,-5; 126 -7.75,-5.4; 127 -7.75,-5.8; 128 -7.75,-6.2
66TSOP-II = smd 0.4 x 1.4: 1 -10.4,-5.925; 2 -9.75,-5.925; 3 -9.1,-5.925; 4 -8.45,-5.925; 5 -7.8,-5.925; 6 -7.15,-5.925; 7 -6.5,-5.925; 8 -5.85,-5.925; 9 -5.2,-5.925; 10 -4.55,-5.925; 11 -3.9,-5.925; 12 -3.25,-5.925; 13 -2.6,-5.925; 14 -1.95,-5.925; 15 -1.3,-5.925; 16 -0.65,-5.925; 17 0,-5.925; 18 0.65,-5.925; 19 1.3,-5.925; 20 1.95,-5.925; 21 2.6,-5.925; 22 3.25,-5.925; 23 3.9,-5.925; 24 4.55,-5.925; 25 5.2,-5.925; 26 5.85,-5.925; 27 6.5,-5.925; 28 7.15,-5.925; 29 7.8,-5.925; 30 8.45,-5.925; 31 9.1,-5.925; 32 9.75,-5.925; 33 10.4,-5.925; 34 10.4,5.925; 35 9.75,5.925; 36 9.1,5.925; 37 8.45,5.925; 38 7.8,5.925; 39 7.15,5.925; 40 6.5,5.925; 41 5.85,5.925; 42 5.2,5.925; 43 4.55,5.925; 44 3.9,5.925; 45 3.25,5.925; 46 2.6,5.925; 47 1.95,5.925; 48 1.3,5.925; 49 0.65,5.925; 50 0,5.925; 51 -0.65,5.925; 52 -1.3,5.925; 53 -1.95,5.925; 54 -2.6,5.925; 55 -3.25,5.925; 56 -3.9,5.925; 57 -4.55,5.925; 58 -5.2,5.925; 59 -5.85,5.925; 60 -6.5,5.925; 61 -7.15,5.925; 62 -7.8,5.925; 63 -8.45,5.925; 64 -9.1,5.925; 65 -9.75,5.925; 66 -10.4,5.925
TSOP48 = smd 1.2 x 0.25: 1 -9.9,5.75; 2 -9.9,5.25; 3 -9.9,4.75; 4 -9.9,4.25; 5 -9.9,3.75; 6 -9.9,3.25; 7 -9.9,2.75; 8 -9.9,2.25; 9 -9.9,1.75; 10 -9.9,1.25; 11 -9.9,0.75; 12 -9.9,0.25; 13 -9.9,-0.25; 14 -9.9,-0.75; 15 -9.9,-1.25; 16 -9.9,-1.75; 17 -9.9,-2.25; 18 -9.9,-2.75; 19 -9.9,-3.25; 20 -9.9,-3.75; 21 -9.9,-4.25; 22 -9.9,-4.75; 23 -9.9,-5.25; 24 -9.9,-5.75; 25 9.9,-5.75; 26 9.9,-5.25; 27 9.9,-4.75; 28 9.9,-4.25; 29 9.9,-3.75; 30 9.9,-3.25; 31 9.9,-2.75; 32 9.9,-2.25; 33 9.9,-1.75; 34 9.9,-1.25; 35 9.9,-0.75; 36 9.9,-0.25; 37 9.9,0.25; 38 9.9,0.75; 39 9.9,1.25; 40 9.9,1.75; 41 9.9,2.25; 42 9.9,2.75; 43 9.9,3.25; 44 9.9,3.75; 45 9.9,4.25; 46 9.9,4.75; 47 9.9,5.25; 48 9.9,5.75
QFN50P900X900X100-65N = smd 0.813 x 0.305: 1 -4.394,3.759; 2 -4.394,3.251; 3 -4.394,2.743; 4 -4.394,2.261; 5 -4.394,1.753; 6 -4.394,1.245; 7 -4.394,0.762; 8 -4.394,0.254; 9 -4.394,-0.254; 10 -4.394,-0.762; 11 -4.394,-1.245; 12 -4.394,-1.753; 13 -4.394,-2.261; 14 -4.394,-2.743; 15 -4.394,-3.251; 16 -4.394,-3.759; 33 4.394,-3.759; 34 4.394,-3.251; 35 4.394,-2.743; 36 4.394,-2.261; 37 4.394,-1.753; 38 4.394,-1.245; 39 4.394,-0.762; 40 4.394,-0.254; 41 4.394,0.254; 42 4.394,0.762; 43 4.394,1.245; 44 4.394,1.753; 45 4.394,2.261; 46 4.394,2.743; 47 4.394,3.251; 48 4.394,3.759 | smd 0.305 x 0.813: 17 -3.759,-4.394; 18 -3.251,-4.394; 19 -2.743,-4.394; 20 -2.261,-4.394; 21 -1.753,-4.394; 22 -1.245,-4.394; 23 -0.762,-4.394; 24 -0.254,-4.394; 25 0.254,-4.394; 26 0.762,-4.394; 27 1.245,-4.394; 28 1.753,-4.394; 29 2.261,-4.394; 30 2.743,-4.394; 31 3.251,-4.394; 32 3.759,-4.394; 49 3.759,4.394; 50 3.251,4.394; 51 2.743,4.394; 52 2.261,4.394; 53 1.753,4.394; 54 1.245,4.394; 55 0.762,4.394; 56 0.254,4.394; 57 -0.254,4.394; 58 -0.762,4.394; 59 -1.245,4.394; 60 -1.753,4.394; 61 -2.261,4.394; 62 -2.743,4.394; 63 -3.251,4.394; 64 -3.759,4.394 | smd 7.391 x 7.391: 65 0,0
QFN50P800X800X100-57N = smd 0.813 x 0.305: 1 -3.988,3.251; 2 -3.988,2.743; 3 -3.988,2.261; 4 -3.988,1.753; 5 -3.988,1.245; 6 -3.988,0.762; 7 -3.988,0.254; 8 -3.988,-0.254; 9 -3.988,-0.762; 10 -3.988,-1.245; 11 -3.988,-1.753; 12 -3.988,-2.261; 13 -3.988,-2.743; 14 -3.988,-3.251; 29 3.988,-3.251; 30 3.988,-2.743; 31 3.988,-2.261; 32 3.988,-1.753; 33 3.988,-1.245; 34 3.988,-0.762; 35 3.988,-0.254; 36 3.988,0.254; 37 3.988,0.762; 38 3.988,1.245; 39 3.988,1.753; 40 3.988,2.261; 41 3.988,2.743; 42 3.988,3.251 | smd 0.305 x 0.813: 15 -3.251,-3.988; 16 -2.743,-3.988; 17 -2.261,-3.988; 18 -1.753,-3.988; 19 -1.245,-3.988; 20 -0.762,-3.988; 21 -0.254,-3.988; 22 0.254,-3.988; 23 0.762,-3.988; 24 1.245,-3.988; 25 1.753,-3.988; 26 2.261,-3.988; 27 2.743,-3.988; 28 3.251,-3.988; 43 3.251,3.988; 44 2.743,3.988; 45 2.261,3.988; 46 1.753,3.988; 47 1.245,3.988; 48 0.762,3.988; 49 0.254,3.988; 50 -0.254,3.988; 51 -0.762,3.988; 52 -1.245,3.988; 53 -1.753,3.988; 54 -2.261,3.988; 55 -2.743,3.988; 56 -3.251,3.988 | smd 5.994 x 5.994: 57 0,0
SO-8 = smd 0.6 x 2.2: 1 -1.905,-2.6; 2 -0.635,-2.6; 3 0.635,-2.6; 4 1.905,-2.6; 5 1.905,2.6; 6 0.635,2.6; 7 -0.635,2.6; 8 -1.905,2.6
D2PAK-3 = smd 1.016 x 3.05: 1 -2.54,-11.31; 3 2.54,-11.31 | smd 10.66 x 8.38: 4 0,0
PN61729-S = drill 0.95 octagon: 1 1.25,4.71; 2 -1.25,4.71; 3 -1.25,2.71; 4 1.25,2.71 | drill 2.3 pad 2.9: S1 -6.02,0; S2 6.02,0

### Placement (x,y rotation side)
C1  86,76 90 top
C2  58,64 0 top
C3  58,69 0 top
C4  58,75 0 top
C5  56,36 270 bottom
C6  50,6 270 top
C7  31,38 0 top
C8  31,25 0 top
C9  64,20 270 top
C10  72,56 0 top
C11  70.5,20 270 top
C12  72,53 0 top
C13  85,28 0 top
C14  85,31 0 top
C15  54,28 180 top
C16  54,30 180 top
C17  54,32.5 180 top
C18  66,51 0 top
C19  66,48 0 top
C20  66,54 0 top
C21  66,57 0 top
C22  62,54 180 top
C23  62,51 180 top
C24  62,48 180 top
C25  62,45 180 top
C26  58,54 180 top
C27  58,51 180 top
C28  58,48 180 top
C29  58,45 180 top
C30  50,36 270 top
C31  52.5,36 270 top
C32  55,36 270 top
C33  57.5,36 270 top
C34  54,24 180 top
C35  60,16 180 top
C36  54,16 0 top
C37  54,30 0 bottom
C38  54,32.5 0 bottom
C39  54,26 0 top
C40  73,59 270 top
C41  71,59 270 top
C42  60,7 180 top
C43  88,10 180 top
C44  86,39 90 bottom
C45  89,39 90 bottom
C46  64,22 90 bottom
C47  69,22 90 bottom
C48  71.5,22 90 bottom
C49  75,22 90 bottom
C50  77.5,22 90 bottom
C51  80,22 90 bottom
C52  89,44 270 bottom
C53  83,44 270 bottom
C54  31,30 0 top
C55  26,41 90 top
C56  31,32 0 top
C57  31,27 0 top
C58  24,41 90 top
C59  16,41 90 top
C60  18,23 270 top
C61  14,41 90 top
C62  24,23 270 top
C63  13,28 180 top
C64  13,35 180 top
C65  13,30 180 top
C66  20,23 270 top
C67  39,23 0 top
C68  39,25 0 top
C69  23,15 0 top
C70  23,12 0 top
C71  23,18 0 top
C72  23,6 0 top
C73  23,9 0 top
C74  44,31 90 top
C75  44,35 270 top
C76  20,41 90 top
C77  8,49 270 top
C78  24,73 0 top
C79  24,70 0 top
C80  24,76 0 top
C81  24,64 0 top
C82  24,67 0 top
C83  22,46 90 top
C84  44,44 90 top
C85  44,48 270 top
C86  22,54 180 top
C87  22,56 180 top
C88  22,52 180 top
C89  22,50 180 top
C90  22,58 180 top
C91  37,63 90 top
C92  40,58 0 top
C93  40,56 0 top
C94  40,54 0 top
C95  35,63 90 top
C96  35,46 270 top
C97  33,46 270 top
C99  34,67 0 top
D1  49,27 90 top
HC49US  40,33 90 top
HC49US1  40,46 90 top
J1  93,72 180 top
JP1  47,14 270 top
L1  26,23 90 top
L2  52,51 90 top
L3  69,59 270 top
L4  35,27 270 top
L5  26,46 90 top
L6  20,46 90 top
L7  33,63 90 top
LED1  13,33 180 top
LED2  10,52 0 top
LED3  6,52 180 top
LED4  35,42 270 top
Q1  57,19.75 0 top
R1  52,35 180 bottom
R2  52,38 180 bottom
R3  56,6 90 top
R4  53,6 90 top
R5  7,22 180 top
R6  7,25 180 top
R7  72,50 180 top
R8  77,62 180 top
R9  79,48 180 top
R10  79,50 180 top
R11  77,58 180 top
R12  77,60 0 top
R13  60,13 180 top
R14  60,10 180 top
R15  60,4 0 top
R16  80,44 270 bottom
R17  86,44 270 bottom
R18  66.5,22 270 bottom
R19  68.5,20 270 top
R20  79,9 90 bottom
R21  76,9 90 bottom
R22  70,9 90 bottom
R23  64,9 90 bottom
R24  85,9 90 bottom
R25  82,9 90 bottom
R26  73,9 90 bottom
R27  67,9 90 bottom
R28  28,9 180 top
R29  28,6 180 top
R30  28,12 180 top
R31  28,15 180 top
R32  28,18 180 top
R33  9,34 270 top
R34  36,33 90 top
R35  22,41 90 top
R36  31,36 180 top
R37  18,41 90 top
R38  31,23 180 top
R39  22,23 90 top
R40  10,49 270 top
R41  6,49 270 top
R42  10,55 180 top
R43  6,55 180 top
R44  29,67 180 top
R45  29,64 180 top
R46  29,70 180 top
R47  29,73 180 top
R48  29,76 180 top
R49  32,43 0 top
R50  17,58 180 top
R51  24,46 270 top
R52  31,46 270 top
RJ1  8,11 180 top
RJ2  9,69 180 top
S1  41.25,16 90 top
S2  34.25,16 270 top
SD/MMC1  91,55 0 top
SW1  92,19 270 top
T1  55,11 0 top
T2  51.25,11 0 top
U1  71,32 0 top
U2  70,32 0 bottom
U3  74,9 0 top
U4  22,31.75 270 top
U5  31.25,54.25 0 top
U6  8,42 0 top
U$1  68,71 90 top
X1  38.5,3.75 0 top

### Tracks (layer width: path | path; a pad name or v marks a point on that pad's centre or on a via)
1V2
  Top 0.254: C9.1 64.8,21.75 U1.1 64.8,25.3 65.25,25.75 65.25,32 66,32.75 U1.93 66,45 68.5,47.5 68.5,53.45 C10.1
3V3  (via drill 0.3)  (43 unrouted)
  Top 0.254: 59.05,8.5 R14.2 R13.2 | 59.05,8.5 C42.2 59.05,6.8 | 59.05,8.5 62.25,8.5 63,9.25 U3.12 66.25,9.25 69,12 v69,17.5 69,18.55 R19.2 69,19.05 | R8.2 74.5,62 | 74.5,62 71,62 L3.1 | R11.2 75.25,58 v74.75,58.5 74.5,58.75 74.5,62 | R9.2 R10.2 v76.75,50 | v74.75,54.5 72.55,54.5 C12.1 69,50.95 69,47.25 66.4,44.65 U1.92 66.4,32.4 65.75,31.75 65.75,29.75 67.25,28.25 68.5,28.25 71.6,25.15 U1.18 71.6,22.05 C11.1 69,19.45 69,19.05 | 69,19.05 69.1,19.05 | U3.37 85.5,9.25 | 87,13.05 C43.2
  Bottom 0.254: v74.75,58.5 v74.75,54.5 76.75,52.5 v76.75,50 | v69,17.5 69.25,17.75 74.5,17.75 75.25,18.5 85.25,18.5 v87,16.75
5V0  (6 unrouted)
  Top 0.254: U1.102 61.7,36.2 61,35.5 59.75,35.5 59,36.25 59,37.5 58.25,38.25 49.25,38.25
AUART1_RX  (via drill 0.3)
  Top 0.254: v61,22 61.75,22.75 61.75,25.75 61.8,25.8 U1.128
  Bottom 0.254: JP1.4 50,14.46 50,18 53.25,21.25 60.25,21.25 v61,22
AUART1_TX  (via drill 0.3)
  Top 0.254: U1.127 61.45,26.2 61.25,26 61.25,23.25 v60,22
  Bottom 0.254: v60,22 59.75,21.75 53,21.75 49.5,18.25 49.5,16.5 JP1.3
DCDC_BATTERY  (via drill 0.3)
  Top 0.254: C30.1 51.25,36.95 | 51.25,36.95 C31.1 C32.1 C33.1 58.3,36.95 58.5,36.75 58.5,35.75 v59.25,35 61.25,35 62.05,35.8 U1.103 | U1.100 60.25,37 v59.75,36.5 | D1.A 51.25,33.06 51.25,36.95
  Bottom 0.254: v59.75,36.5 59.75,35.5 v59.25,35
DCDC_VDDA  (via drill 0.3)
  Top 0.254: v61,31.75 62.25,33 U1.110 64.25,33 64.5,33.25 64.5,34.5 64.8,34.8 U1.96 64.8,41.45 64,42.25 64,43.25 63.5,43.75 60,43.75 58.95,44.8 C29.1 C28.1 C27.1 C26.1 | v58.75,31.75 v56.75,31.75
  Bottom 0.254: v61,31.75 v58.75,31.75 | v56.75,31.75 55.7,31.75 C38.1 C37.1
DCDC_VDDD
  Top 0.254: U1.94 65.6,42.15 65.05,42.7 C19.1 C18.1 C20.1 C21.1
DCDC_VDDIO
  Top 0.254: U1.95 65.2,41.8 64.5,42.5 64.5,43.45 C25.1 C24.1 C23.1 C22.1
DEBUG
  Top 0.254: U1.89 67.6,44.35 70,46.75 70,48.95 R7.2
DUART_RX  (via drill 0.3)
  Top 0.254: U1.125 60.75,27 60.25,26.5 60.25,24.25 59,23 v58,23
  Bottom 0.254: v58,23 52.5,23 48.58,19.08 JP1.1
DUART_TX  (via drill 0.3)
  Top 0.254: v60.25,23.25 60.75,23.75 60.75,26.25 61.1,26.6 U1.126
  Bottom 0.254: JP1.2 47.04,16.54 52.75,22.25 59.25,22.25 v60.25,23.25
EMI_A00  (via drill 0.3)
  Top 0.254: U1.76 72.8,32.55 v72.5,32.25
  Bottom 0.254: U2.29 62.2,27.2 67,32 72.25,32 v72.5,32.25
EMI_A01  (via drill 0.3)
  Top 0.254: U1.75 73.2,32.55 v73.5,32.25
  Bottom 0.254: v73.5,32.25 72.75,33 72.25,33 71.75,32.5 66.75,32.5 61.55,27.3 U2.30
EMI_A02  (via drill 0.3)
  Top 0.254: U1.74 73.6,33.15 v74.5,32.25
  Bottom 0.254: v74.5,32.25 73.25,33.5 72,33.5 71.5,33 66.5,33 60.9,27.4 U2.31
EMI_A03  (via drill 0.3)
  Top 0.254: U1.73 74,33.75 v74.25,33.5
  Bottom 0.254: v74.25,33.5 73.75,34 71.75,34 71.25,33.5 66.25,33.5 60.25,27.5 U2.32
EMI_A04  (via drill 0.3)
  Top 0.254: v73.5,45.25 73.5,41.75 74.4,40.85 U1.72
  Bottom 0.254: U2.35 60.25,41 64.25,45 73.25,45 v73.5,45.25
EMI_A05  (via drill 0.3)
  Top 0.254: v74.5,45 74.25,44.75 74.25,41.75 74.8,41.2 U1.71
  Bottom 0.254: U2.36 60.9,40.9 64.5,44.5 74,44.5 v74.5,45
EMI_A06  (via drill 0.3)
  Top 0.254: U1.70 75.2,41.55 74.75,42 74.75,44.25 75.5,45 v76,45
  Bottom 0.254: U2.37 61.55,40.8 64.75,44 74.5,44 75.5,45 v76,45
EMI_A07  (via drill 0.3)
  Top 0.254: v75.5,44 75.25,43.75 75.25,42.25 75.6,41.9 U1.69
  Bottom 0.254: U2.38 62.2,40.7 65,43.5 75,43.5 v75.5,44
EMI_A08  (via drill 0.3)
  Top 0.254: v76.5,44 75.75,43.25 75.75,42.5 76,42.25 U1.68
  Bottom 0.254: U2.39 62.85,40.6 65.25,43 75.5,43 v76.5,44
EMI_A09  (via drill 0.3)
  Top 0.254: v76.5,43 76.4,42.9 U1.67
  Bottom 0.254: U2.40 63.5,40.5 65.5,42.5 76,42.5 v76.5,43
EMI_A10  (via drill 0.3)
  Top 0.254: v76.25,35.5 76.25,37 76.8,37.55 U1.66
  Bottom 0.254: v76.25,35.5 78.25,33.5 78.25,32.75 77,31.5 67.25,31.5 62.85,27.1 U2.28
EMI_A11  (via drill 0.3)
  Top 0.254: v77.5,42.75 77.2,42.45 U1.65
  Bottom 0.254: U2.41 64.15,40.4 65.75,42 76.75,42 v77.5,42.75
EMI_A12  (via drill 0.3)
  Top 0.254: v83,37.75 82.55,38.2 U1.64
  Bottom 0.254: U2.42 64.8,40.05 66.25,41.5 82,41.5 82.75,40.75 82.75,38 v83,37.75
EMI_BA0  (via drill 0.3)
  Top 0.254: U1.79 71.6,35.6 70.5,34.5 70.5,32.25 v69,30.75
  Bottom 0.254: U2.26 64.15,26.9 67.25,30 68.25,30 v69,30.75
EMI_BA1  (via drill 0.3)
  Top 0.254: U1.80 71.2,35.95 70,34.75 70,32.75 v68,30.75
  Bottom 0.254: U2.27 63.5,27 67.25,30.75 v68,30.75
EMI_CASN  (via drill 0.3)
  Top 0.254: U1.61 81.25,37 82,36.25 82,31.75 v81.5,31.25
  Bottom 0.254: U2.22 66.75,27.25 68,28.5 69.25,28.5 70.75,30 77.75,30 79.75,32 80.75,32 v81.5,31.25
EMI_CE0N  (via drill 0.3)
  Top 0.254: v83.25,32.5 83.25,36.5 81.95,37.8 U1.63
  Bottom 0.254: R18.1 65.45,24 U2.24 65.45,27.45 67.5,29.5 68.75,29.5 70.25,31 77.25,31 79.25,33 82.75,33 v83.25,32.5
EMI_CKE  (via drill 0.3)
  Top 0.254: U1.78 72,35 v71.75,34.75
  Bottom 0.254: v71.75,34.75 71,34 68.5,34 67.5,35 67.5,35.5 66.1,36.9 U2.44
EMI_CLK  (via drill 0.3)
  Top 0.254: U1.36 77.25,27 76.25,26 71.5,26 68.75,28.75 67.5,28.75 66.25,30 66.25,31.5 68.25,33.5 v68.25,35.25
  Bottom 0.254: U2.45 66.75,37 68.25,35.5 v68.25,35.25
EMI_CLKN  (via drill 0.3)
  Top 0.254: U1.37 76.9,27.4 76,26.5 71.75,26.5 69,29.25 67.75,29.25 66.75,30.25 66.75,31.25 69,33.5 69,35.5 69.25,35.75 v69.25,36
  Bottom 0.254: U2.46 67.4,37.1 68.5,36 v69.25,36
EMI_D00  (via drill 0.3)
  Top 0.254: U1.41 80,29 80.75,28.25 81.25,28.25 81.75,28.75 82.5,28.75 v82.75,28.5
  Bottom 0.254: U2.2 79.75,26.75 80.25,27.25 82.25,27.25 82.75,27.75 v82.75,28.5
EMI_D01  (via drill 0.3)
  Top 0.254: U1.43 81.45,29.8 v81.75,29.5
  Bottom 0.254: U2.4 78.45,27.2 79.5,28.25 81.25,28.25 81.75,28.75 v81.75,29.5
EMI_D02  (via drill 0.3)
  Top 0.254: U1.42 80.6,29.4 v81,29
  Bottom 0.254: U2.5 77.8,27.3 79.25,28.75 80.75,28.75 v81,29
EMI_D03  (via drill 0.3)
  Top 0.254: U1.44 76.45,30.2 76,29.75 v76,28.25
  Bottom 0.254: v76,28.25 76.5,27.75 U2.7
EMI_D04  (via drill 0.3)
  Top 0.254: U1.47 76.9,31.4 75,29.5 v75,28
  Bottom 0.254: U2.8 75.85,27.15 v75,28
EMI_D05  (via drill 0.3)
  Top 0.254: U1.48 76.55,31.8 74,29.25 v74,27.75
  Bottom 0.254: U2.10 74.55,27.2 v74,27.75
EMI_D06  (via drill 0.3)
  Top 0.254: U1.49 76.2,32.2 73.25,29.25 v73.25,28.25
  Bottom 0.254: U2.11 73.9,26.85 73.25,27.5 v73.25,28.25
EMI_D07  (via drill 0.3)
  Top 0.254: U1.50 75.85,32.6 72.5,29.25 v72.5,27.75
  Bottom 0.254: U2.13 72.6,27.9 v72.5,27.75
EMI_D08  (via drill 0.3)
  Top 0.254: U1.51 v75,33
  Bottom 0.254: U2.54 72.6,36.15 75,33.75 v75,33
EMI_D09  (via drill 0.3)
  Top 0.254: U1.52 76.1,33.4 v75.75,33.75
  Bottom 0.254: U2.56 73.9,35.6 v75.75,33.75
EMI_D10  (via drill 0.3)
  Top 0.254: U1.54 77.05,34.2 v76.75,34
  Bottom 0.254: U2.57 74.55,35.95 76.5,34 v76.75,34
EMI_D11  (via drill 0.3)
  Top 0.254: U1.55 76.15,34.6 75.25,35.5 v75.25,36.5
  Bottom 0.254: v75.25,36.5 75.85,37.1 U2.59
EMI_D12  (via drill 0.3)
  Top 0.254: U1.57 77.35,35.4 v77.25,35.5
  Bottom 0.254: v77.25,35.5 76.5,36.25 U2.60
EMI_D13  (via drill 0.3)
  Top 0.254: U1.58 77.95,35.8 v77.25,36.5
  Bottom 0.254: v77.25,36.5 77.8,37.05 U2.62
EMI_D14  (via drill 0.3)
  Top 0.254: U1.60 80.9,36.6 81.25,36.25 v81.25,35.25
  Bottom 0.254: U2.63 78.45,36.8 80,35.25 v81.25,35.25
EMI_D15  (via drill 0.3)
  Top 0.254: U1.59 80.05,36.2 v80.25,36
  Bottom 0.254: U2.65 79.75,36.5 v80.25,36
EMI_DQM0  (via drill 0.3)
  Top 0.254: U1.46 80,31 v80.25,31.25
  Bottom 0.254: v80.25,31.25 78.5,29.5 72.25,29.5 70.25,27.5 68.5,27.5 68.05,27.05 U2.20
EMI_DQM1  (via drill 0.3)
  Top 0.254: U1.56 79.75,35 v80.25,34.5
  Bottom 0.254: U2.47 68.05,39.05 68.5,39.5 72.5,39.5 74,41 81.75,41 82.25,40.5 82.25,35 81.75,34.5 v80.25,34.5
EMI_DQS0  (via drill 0.3)
  Top 0.254: U1.39 77.7,28.2 v77.5,28
  Bottom 0.254: v77.5,28 76.5,29 72.5,29 70.65,27.15 U2.16
EMI_DQS1  (via drill 0.3)
  Top 0.254: v70.25,36 69.5,35.25 69.5,33.25 67.25,31 67.25,30.5 68,29.75 69.25,29.75 72,27 75.75,27 76.75,28 76.75,28.25 77.1,28.6 U1.40
  Bottom 0.254: v70.25,36 70.65,36.4 U2.51
EMI_RASN  (via drill 0.3)
  Top 0.254: U1.62 81.6,37.4 82.5,36.5 v82.5,31.25
  Bottom 0.254: U2.23 66.1,27.35 67.75,29 69,29 70.5,30.5 77.5,30.5 79.5,32.5 81.25,32.5 v82.5,31.25
EMI_WEN  (via drill 0.3)
  Top 0.254: U1.77 72.4,34.15 71,32.75 v71,29.25
  Bottom 0.254: U2.21 67.4,27.15 68.25,28 69.75,28 v71,29.25
GND  (155 unrouted)
GPMI_ALE
  Top 0.254: U3.17 65.25,6.75 70,11.5 70,15.75 72.4,18.15 U1.20
GPMI_CE0N  (via drill 0.3)
  Top 0.254: U3.9 v62.5,10.75 61.7,10.75 R14.1 | U1.82 70.4,38.4 67.25,35.25 v67.25,34.25 | v65.25,34.25 65.25,32.75 64.75,32.25 64.75,25.75 62.5,23.5 v62.5,13
  Bottom 0.254: v67.25,34.25 v65.25,34.25 | v62.5,13 v62.5,10.75
GPMI_CLE
  Top 0.254: U3.16 65,7.25 69.5,11.75 69.5,16 72,18.5 U1.19
GPMI_D00
  Top 0.254: U1.22 73.2,8.55 76.5,5.25 U3.29
GPMI_D01
  Top 0.254: U1.23 73.6,8.9 76.75,5.75 U3.30
GPMI_D02
  Top 0.254: U1.24 74,9.25 77,6.25 U3.31
GPMI_D03
  Top 0.254: U1.25 74.4,9.6 77.25,6.75 U3.32
GPMI_D04  (via drill 0.3)
  Top 0.254: U1.27 75.2,14.55 v75.5,14.25 | v75.25,12.5 76.5,11.25 U3.41
  Bottom 0.254: v75.25,12.5 75.25,14 v75.5,14.25
GPMI_D05
  Top 0.254: U1.26 74.8,13.95 77,11.75 U3.42
GPMI_D06  (via drill 0.3)
  Top 0.254: U1.29 76,16 v77.5,14.5 | U3.43 77.75,12.25 v77.5,12.5
  Bottom 0.254: v77.5,14.5 v77.5,12.5
GPMI_D07
  Top 0.254: U1.28 75.6,15.4 78.25,12.75 U3.44
GPMI_RDN  (via drill 0.3)
  Top 0.254: U3.8 67.5,11.25 68.5,12.25 68.5,14 v68.25,14.25 | U1.31 76.8,16.2 v77.25,15.75
  Bottom 0.254: v68.25,14.25 74.25,14.25 75.75,15.75 v77.25,15.75
GPMI_RDY0  (via drill 0.3)
  Top 0.254: R13.1 62.2,11.75 U3.7 67.25,11.75 68,12.5 68,13.5 67.5,14 67.5,14.75 v68,15.25 | U1.32 77.2,17.05 v78,16.25
  Bottom 0.254: v68,15.25 74.5,15.25 75.75,16.5 77.75,16.5 v78,16.25
GPMI_WPN  (via drill 0.3)
  Top 0.254: R15.2 62.7,5.75 U3.19 65.75,5.75 71,11 71,14.75 v72.25,16 | U1.34 79.8,26.2 81.25,24.75 81.25,19.5 78.75,17 v78.5,17
  Bottom 0.254: v72.25,16 74.5,16 75.5,17 v78.5,17
GPMI_WRN  (via drill 0.3)
  Top 0.254: U3.18 65.5,6.25 70.5,11.25 70.5,15.25 v72.25,17 | U1.33 79.45,25.8 80.75,24.5 80.75,20.25 78.25,17.75 v78,17.75
  Bottom 0.254: v72.25,17 74.75,17 75.25,17.5 77.75,17.5 v78,17.75
LCD_D00  (via drill 0.3)
  Top 0.254: U1.2 65.2,17.45 v64.25,16.5
  Bottom 0.254: 64.05,8 R23.2 | R23.2 R27.2 | v64.25,16.5 64,16.25 R23.2
LCD_D01  (via drill 0.3)
  Top 0.254: U1.3 65.6,16.85 v65.25,16.5
  Bottom 0.254: R26.2 R22.2 65.25,14.7 v65.25,16.5
LCD_D02  (via drill 0.3)
  Top 0.254: U1.4 66,17.5 v66.25,17.25
  Bottom 0.254: R25.2 81.05,9 76.95,9 R21.2 76,10 74.5,11.5 69.25,11.5 66.25,14.5 v66.25,17.25
LCD_D03  (via drill 0.3)
  Top 0.254: U1.5 66.4,18.1 67,17.5 v67,16.5
  Bottom 0.254: v67,16.5 67,14.5 69.5,12 74.75,12 75.5,11.25 77.7,11.25 | 77.7,11.25 R20.2 | R24.2 83.7,11.25 77.7,11.25
N$1  (2 unrouted)
N$2  (2 unrouted)
  Top 0.254: 54.75,3.5 56,4.75 R3.1
N$3  (2 unrouted)
  Bottom 0.254: R1.1 R2.1
N$4
  Top 0.254: T1.1 54.05,8 R4.2 | R4.2 R3.2 | R4.2 C6.1
N$5  (1 unrouted)
  Bottom 0.254: 86.25,6.25 80.8,6.25 R20.1
N$6  (1 unrouted)
  Bottom 0.254: 88.67,5.75 78.3,5.75 R21.1
N$7  (1 unrouted)
  Bottom 0.254: 87.67,5.25 72.8,5.25 R22.1
N$8  (1 unrouted)
  Bottom 0.254: 85.63,4.75 67.3,4.75 R23.1
N$9
  Top 0.254: L2.2 52.25,54 55,51.25 55,43 59.8,38.2 U1.97
N$10  (1 unrouted)
N$11
  Top 0.254: 52,47.75 L2.1 52,45 59.85,37.4 U1.99
N$12
  Top 0.254: U1.117 60.3,30.2 60,30.5 59.5,30.5 56.75,27.75 56.75,26.25 56.5,26 C39.2
N$13
  Top 0.254: R19.1 70,22.45 U1.14
N$14  (1 unrouted)
N$15  (3 unrouted)
N$16
  Top 0.254: SD/MMC1.4 82.8,53.95 80.25,56.5 74.55,56.5 C40.2 C41.2 69.05,58.05 L3.2
N$17  (3 unrouted)
N$18  (1 unrouted)
N$19  (3 unrouted)
N$20  (1 unrouted)
N$21  (1 unrouted)
N$22  (2 unrouted)
N$23  (1 unrouted)
N$24  (1 unrouted)
N$25  (1 unrouted)
N$26  (via drill 0.3)
  Top 0.254: v77.75,44 v81.5,40.25
  Bottom 0.254: U2.49 69.35,38.85 69.5,39 72.75,39 74.25,40.5 81.25,40.5 v81.5,40.25 | v77.75,44 78.7,43.05 R16.2 C53.2 83.55,43.05 85.25,44.75 85.8,44.75 R17.1 C52.1
N$27  (1 unrouted)
N$28  (1 unrouted)
N$29  (1 unrouted)
N$30  (3 unrouted)
N$31  (1 unrouted)
N$32  (1 unrouted)
N$33  (2 unrouted)
N$34  (1 unrouted)
N$35  (1 unrouted)
N$36  (1 unrouted)
NFDX_LED  (1 unrouted)
NFDX_LED_2  (1 unrouted)
NLNKA_LED  (1 unrouted)
NLNKA_LED_2  (1 unrouted)
NSPD_LED  (1 unrouted)
NSPD_LED_2  (1 unrouted)
PRTCTL2  (2 unrouted)
PRTCTL3  (2 unrouted)
PSWITCH  (via drill 0.3)
  Top 0.254: U1.119 60.1,29.4 v59.75,29.75
  Bottom 0.254: v59.75,29.75 56,33.5 C5.1 54.95,38 R2.2
RXN  (3 unrouted)
RXN_2  (3 unrouted)
RXP  (3 unrouted)
RXP_2  (3 unrouted)
SSP1_CMD  (via drill 0.3)
  Top 0.254: SD/MMC1.3 82.7,55.05 79.75,58 R11.1 | U1.83 70,43 73,46 75,46 v75.25,45.75 | 83.67,55 SD/MMC1.3 | v85.25,55 85.2,55.05 SD/MMC1.3
  Bottom 0.254: v75.25,45.75 80.75,45.75 86.75,51.5 86.75,54 85.75,55 v85.25,55
SSP1_DATA0  (via drill 0.3)
  Top 0.254: U1.84 69.6,43.35 72.75,46.5 v76.25,46.5 | SD/MMC1.7 80.6,50.65 R10.1 79.95,50.55 79.25,51.25 76.75,51.25 75.5,50 v75.5,49.75
  Bottom 0.254: v75.5,49.75 75.5,46.75 75.75,46.5 v76.25,46.5
SSP1_DATA1
  Top 0.254: U1.85 69.2,43.7 72.75,47.25 76.75,47.25 77.25,46.75 79,46.75 79.75,47.5 79.75,47.8 R9.1 81.5,49.55 SD/MMC1.8
SSP1_DATA2  (via drill 0.3)
  Top 0.254: R8.1 82.7,57.25 SD/MMC1.1 85.25,57.25 86.75,55.75 86.75,52.75 v85.75,51.75 | U1.86 68.8,44.05 72.5,47.75 73.5,47.75 74.75,49 74.75,50 76.5,51.75 79.75,51.75 v80,51.5
  Bottom 0.254: v80,51.5 80.25,51.25 85.25,51.25 v85.75,51.75
SSP1_DATA3  (via drill 0.3)
  Top 0.254: R12.2 78.75,60 82.6,56.15 SD/MMC1.2 85.35,56.15 86,55.5 v86,53 | U1.87 68.4,44.4 72.25,48.25 73.25,48.25 74.25,49.25 74.25,50.25 76.25,52.25 80.75,52.25 v81,52
  Bottom 0.254: v81,52 85,52 v86,53
SSP1_SCK
  Top 0.254: U1.90 67.2,44.7 69.5,47 69.5,50.5 70.5,51.5 74.75,51.5 76.1,52.85 SD/MMC1.5
TXN  (3 unrouted)
TXN_2  (3 unrouted)
TXP  (3 unrouted)
TXP_2  (3 unrouted)
USB_DM  (via drill 0.3)  (1 unrouted)
  Top 0.254: U1.123 59.8,27.8 58.75,26.75 v58.75,23.75
  Bottom 0.254: v58.75,23.75 52.5,23.75 50,21.25
USB_DM2  (1 unrouted)
USB_DM3  (1 unrouted)
USB_DP  (via drill 0.3)  (1 unrouted)
  Top 0.254: U1.124 60.15,27.4 59.5,26.75 v59.5,24.5
  Bottom 0.254: 49.75,21.75 52.75,24.75 59.25,24.75 v59.5,24.5
USB_DP2  (1 unrouted)
USB_DP3  (1 unrouted)
USB_PWRA  (2 unrouted)
USB_PWRB  (1 unrouted)
VDD3V3A  (32 unrouted)
VDD4P2  (via drill 0.3)
  Top 0.254: 55,32.05 C17.1 | C17.1 54.95,31.25 | 54.95,31.25 C16.1 | U1.101 61.1,36.6 v60.75,36.25 | v60.5,34.25 60.5,33 60,32.5 C17.1 | D1.C 49,28.5 51.75,31.25 54.95,31.25
  Bottom 0.254: v60.75,36.25 60.5,36 v60.5,34.25
VDD18CORE  (4 unrouted)
VDD18ETHPLL  (2 unrouted)
VDD18USBPLL  (2 unrouted)
VDDCORE  (7 unrouted)
VDDIO_DRAM  (via drill 0.3)
  Top 0.254: U1.45 84.05,30.6 C14.1 | v84,26.5 84.05,26.55 C13.1 C14.1 | v82,28 81.8,27.8 U1.38 | v84,33.25 84,31.05 C14.1 | U1.53 81.2,33.8 v81.25,33.75 | v81.5,39.25 83,39.25 v83.5,38.75
  Bottom 0.254: C51.2 80.4,23.35 U2.1 80.83,26.5 v84,26.5 | C51.2 79.1,23.85 U2.3 79.1,27.1 79.75,27.75 81.75,27.75 v82,28 | C47.2 C48.2 | C48.2 C49.2 | C49.2 C50.2 C51.2 | U2.9 75.2,23.15 C49.2 | U2.15 71.3,23.15 C48.2 | U2.18 69.35,23.3 C47.2 | U2.33 59.6,25.4 62,23 63.95,23 C46.2 64.3,22.95 66,21.25 66.3,21.25 R18.2 C47.2 | U2.55 73.25,38.75 74.5,40 77.15,40 | v81.25,33.75 83.5,33.75 v84,33.25 84,38.25 v83.5,38.75 84.7,39.95 C44.2 | 77.15,40 80.75,40 v81.5,39.25 | U2.61 77.15,40 | C52.2 R17.2 C44.2 | C44.2 C45.2
VDDM/LRADC4
  Top 0.254: C15.1 56.25,28 61,32.75 61,33.75 61.85,34.6 U1.106
VDDPLL2  (2 unrouted)
VDDXTAL  (2 unrouted)
  Top 0.254: U1.120 58.75,29 57.25,27.5 57.25,24.75 56.5,24 C34.1 52.7,21.75 48,21.75
XI  (2 unrouted)
XTALI
  Top 0.254: T1.3 58.9,16 C35.2 59.54,16.49 Q1.2 59.5,19.75 57.25,22 57.25,23.25 58.25,24.25 58.25,27 59.45,28.2 U1.122
XTALO
  Top 0.254: T2.3 54.95,15.8 C36.2 54.46,16.49 Q1.1 54.46,21.21 57.75,24.5 57.75,27.25 59.1,28.6 U1.121